# Altium project LAUNCHXL-F28379D_REV2.0.PrjPcb (part 1 of 2)
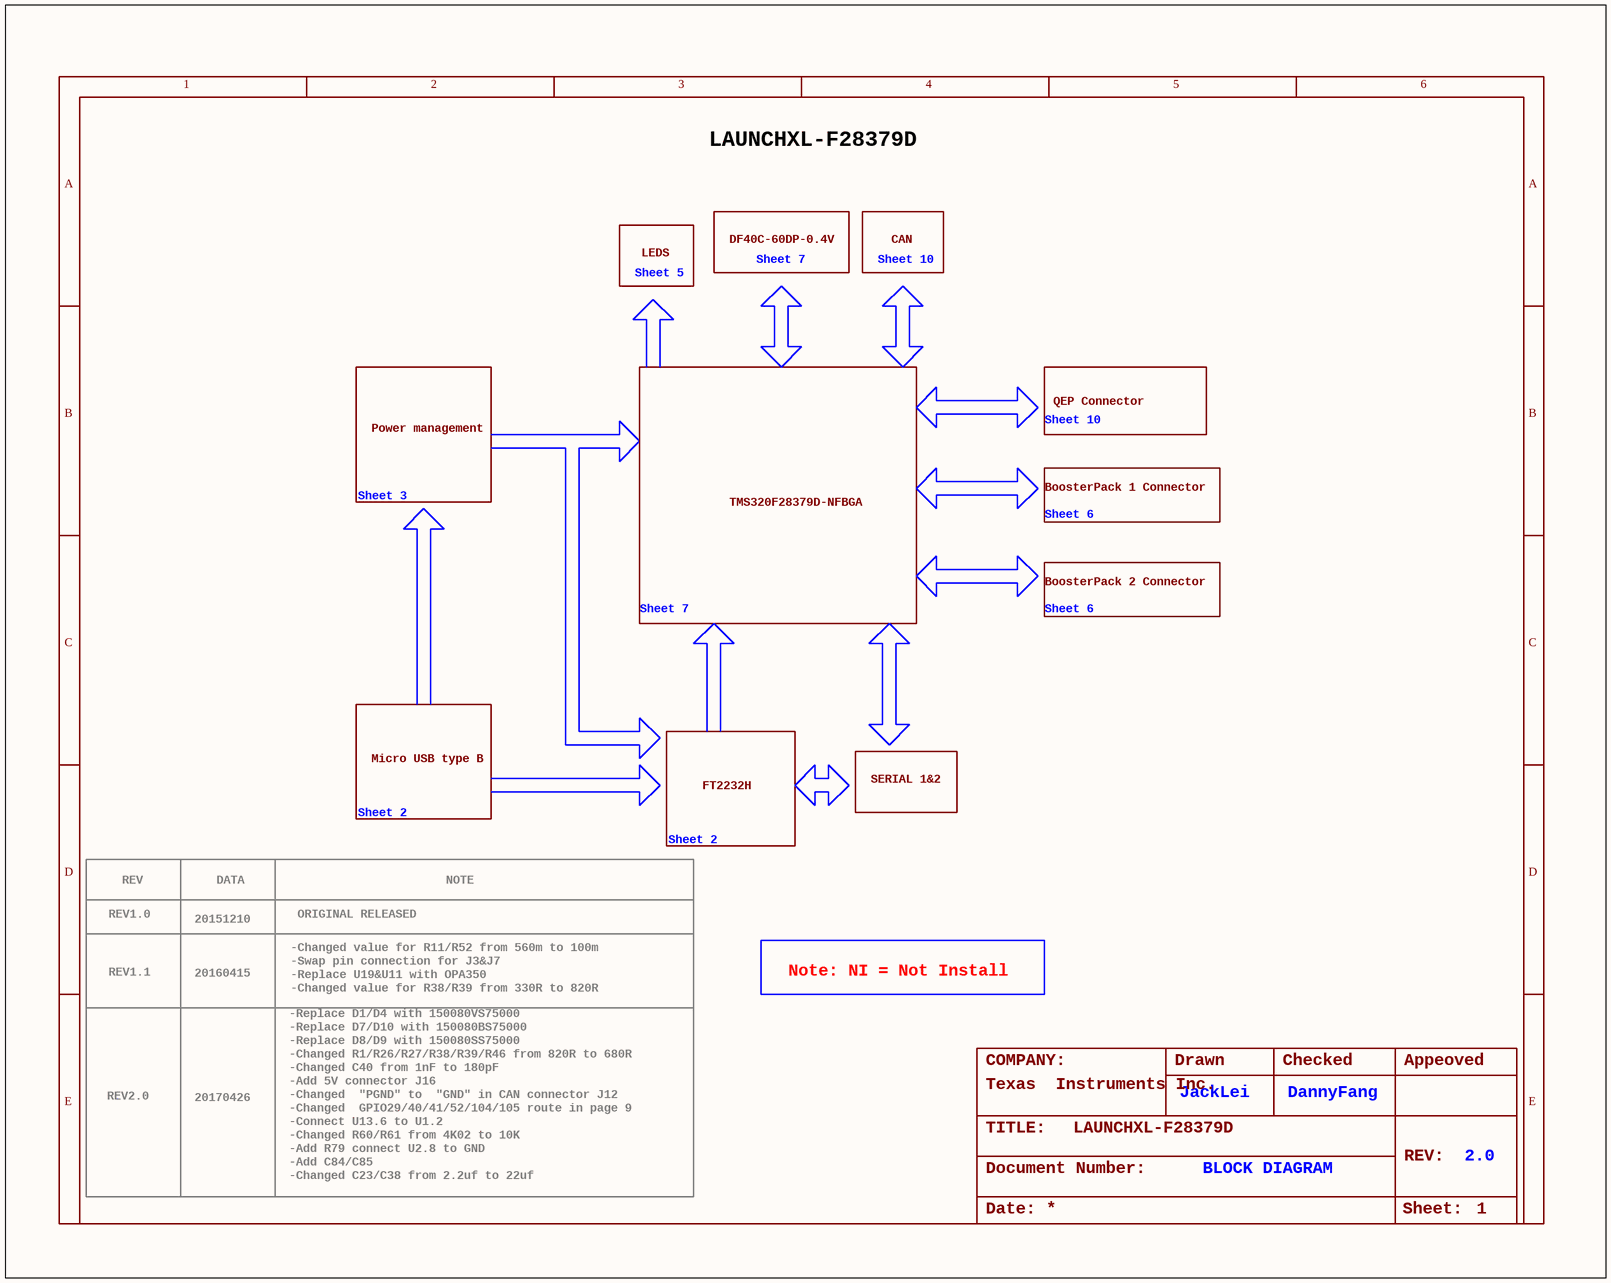
[diagram p0: P01_Block Diagram.SchDoc]
10 sheets, 241 parts. Net scope: global (net labels, ports and power ports of the same name join across sheets).
Board file: LAUNCHXL-F28379D-REV2.0.PcbDoc
Sheets:
  P01_Block Diagram.SchDoc
  P02_XDS100v2.SchDoc
  P03_Power.SchDoc
  P04_ADCIND.SchDoc
  P05_PWM-DAC.SchDoc
  P07_F28379D-PWR.SchDoc
  P08_F28379D-IO1.SchDoc
  P09_F28379D-IO2.SchDoc
  P06_BoosterPack Headers.SchDoc
  P10_EX-Headers.SchDoc

## Sheet P01_Block Diagram.SchDoc
size 301 x 239 mm; SheetNumber: 1; SheetTotal: 10

### Notes on the sheet
- LAUNCHXL-F28379D
- Sheet 5
- LEDS
- DF40C-60DP-0.4V
- Sheet 7
- Sheet 10
- CAN
- QEP Connector
- Power management
- BoosterPack 1 Connector
- Sheet 3
- TMS320F28379D-NFBGA
- Sheet 6
- BoosterPack 2 Connector
- Micro USB type B
- Sheet 2
- FT2232H
- SERIAL 1&2
- REV
- DATA
- NOTE
- REV1.0
- 20151210
- -Changed value for R11/R52 from 560m to 100m
- -Swap pin connection for J3&J7
- ORIGINAL RELEASED
- REV1.1
- 20160415
- -Replace D1/D4 with 150080VS75000
- -Replace D7/D10 with 150080BS75000
- -Replace U19&U11 with OPA350
- -Changed value for R38/R39 from 330R to 820R
- Note: NI = Not Install
- REV2.0
- 20170426
- -Add 5V connector J16
- -Changed R1/R26/R27/R38/R39/R46 from 820R to 680R
- -Replace D8/D9 with 150080SS75000
- -Changed C40 from 1nF to 180pF
- -Changed  "PGND" to  "GND" in CAN connector J12
- COMPANY:
- Texas
  Instruments Inc.
- Drawn
- JackLei
- Checked
- DannyFang
- Appeoved
- -Changed  GPIO29/40/41/52/104/105 route in page 9
- -Connect U13.6 to U1.2
- -Changed R60/R61 from 4K02 to 10K
- -Add R79 connect U2.8 to GND
- -Add C84/C85
- TITLE:
- REV:
- 2.0
- -Changed C23/C38 from 2.2uf to 22uf
- Date:
- Document Number:
- BLOCK DIAGRAM
- Sheet:
- 1
- 2
- 3
- 4
- 5
- 6
- A
- B
- C
- D
- E

## Sheet P02_XDS100v2.SchDoc
size 301 x 239 mm; Revision: 2.0; PageSetup: Record=PageOptions|CenterHorizontal=True|CenterVertical=True|PrintScale=1.00|XCorrection=1.00|YCorrection=1.00|PrintKind=1|BorderSize=5000000|LeftOffset=0|BottomOffset=0|Orientation=2|PaperLength=1000|PaperWidth=1000|Scale=100|PaperSource=7|PrintQuality=-3|MediaType=1|DitherType=10|PrintScaleMode=1|PaperKind=A4 (210 x 297 mm)|PaperIndex=9
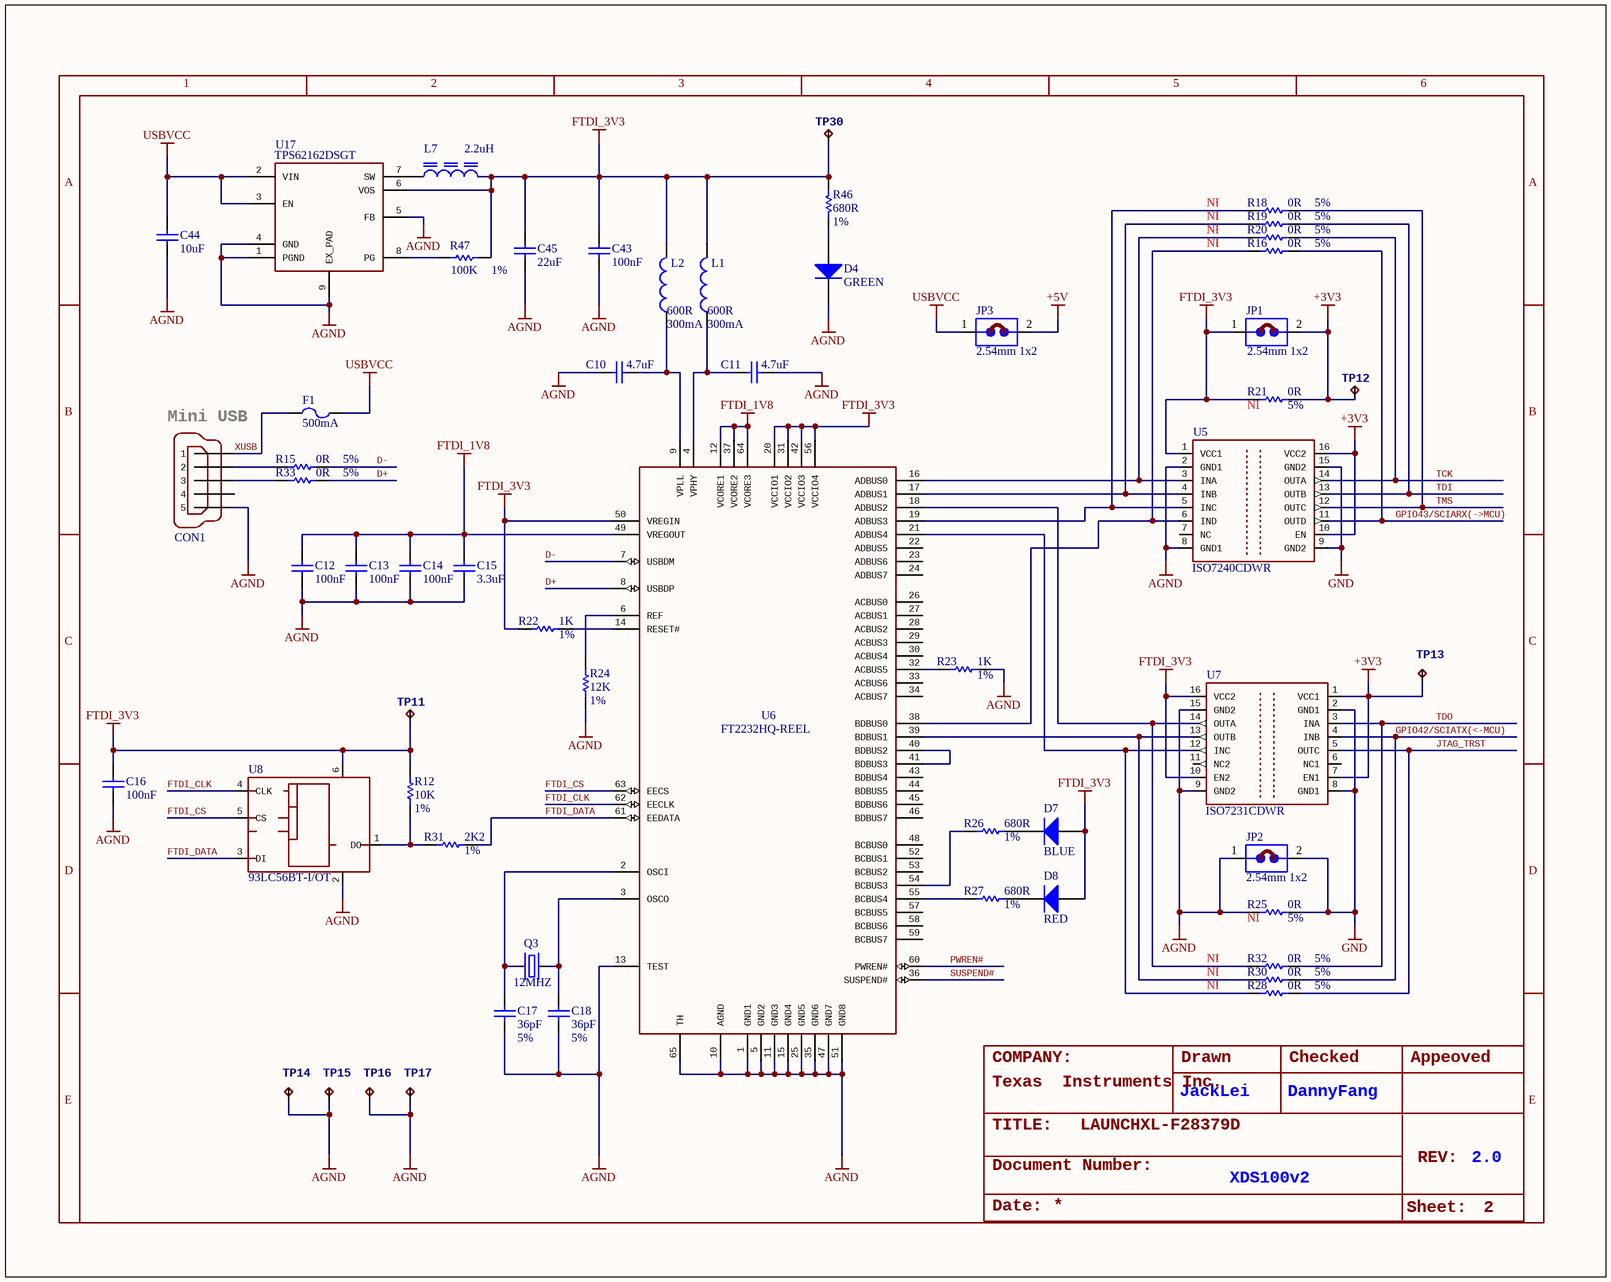
[diagram p1: P02_XDS100v2.SchDoc]

### Parts
C10  4.7uF  [C0402]
C11  4.7uF  [C0402]
C12  100nF  [C0402]
C13  100nF  [C0402]
C14  100nF  [C0402]
C15  3.3uF  [C0603]
C16  100nF  [C0402]
C17  Rating: 5%  [C0402]  (hidden comment: 36pF)
C18  Rating: 5%  [C0402]  (hidden comment: 36pF)
C43  100nF  [C0402]
C44  10uF  [C1210]
C45  22uF  [C1210]
CON1  897-43-005-00-100001  [USB-MINI-B-5P-SMD]  (value not drawn)
D4  value GREEN  [D0805]  (hidden comment: 150080VS75000)
D7  value BLUE  [D0805]  (hidden comment: 150080BS75000)
D8  value RED  [D0805]  (hidden comment: 150080SS75000)
F1  value 500mA  [FUSM4632X85N]  (hidden comment: MF-MSMF050-2)
JP1  value 2.54mm 1x2  [HDRV2W64P254_1X2_508X250X850P]  (hidden comment: P6E02A-602530-B1)
JP2  value 2.54mm 1x2  [HDRV2W64P254_1X2_508X250X850P]  (hidden comment: P6E02A-602530-B1)
JP3  value 2.54mm 1x2  [HDRV2W64P254_1X2_508X250X850P]  (hidden comment: P6E02A-602530-B1)
L1  Rating: 300mA  [L0402]  (hidden comment: 600R)
L2  Rating: 300mA  [L0402]  (hidden comment: 600R)
L7  2.2uH  [INDC300X300X180N]
Q3  value 12MHZ  [XTAL1140X470X330N]  (hidden comment: ABLS2-12.000MHZ-D4Y-T)
R12  Rating: 1%  [R0402]  (hidden comment: 10K)
R15  Rating: 5%  [R0402]  (hidden comment: 0R)
R16  Rating: 5%  ASSY: NI  [R1206]  (hidden comment: 0R)
R18  Rating: 5%  ASSY: NI  [R1206]  (hidden comment: 0R)
R19  Rating: 5%  ASSY: NI  [R1206]  (hidden comment: 0R)
R20  Rating: 5%  ASSY: NI  [R1206]  (hidden comment: 0R)
R21  Rating: 5%  ASSY: NI  [R1206]  (hidden comment: 0R)
R22  Rating: 1%  [R0402]  (hidden comment: 1K)
R23  Rating: 1%  [R0402]  (hidden comment: 1K)
R24  Rating: 1%  [R0402]  (hidden comment: 12K)
R25  Rating: 5%  ASSY: NI  [R1206]  (hidden comment: 0R)
R26  Rating: 1%  [R0402]  (hidden comment: 680R)
R27  Rating: 1%  [R0402]  (hidden comment: 680R)
R28  Rating: 5%  ASSY: NI  [R1206]  (hidden comment: 0R)
R30  Rating: 5%  ASSY: NI  [R1206]  (hidden comment: 0R)
R31  Rating: 1%  [R0402]  (hidden comment: 2K2)
R32  Rating: 5%  ASSY: NI  [R1206]  (hidden comment: 0R)
R33  Rating: 5%  [R0402]  (hidden comment: 0R)
R46  Rating: 1%  [R0402]  (hidden comment: 680R)
R47  Rating: 1%  [R0402]  (hidden comment: 100K)
TP11  TESTPAD_TPB1,27  [TESTPAD_B1,27]  (value not drawn)
TP12  TESTPAD_TPB1,27  [TESTPAD_B1,27]  (value not drawn)
TP13  TESTPAD_TPB1,27  [TESTPAD_B1,27]  (value not drawn)
TP14  TESTPAD_TPB1,27  [TESTPAD_B1,27]  (value not drawn)
TP15  TESTPAD_TPB1,27  [TESTPAD_B1,27]  (value not drawn)
TP16  TESTPAD_TPB1,27  [TESTPAD_B1,27]  (value not drawn)
TP17  TESTPAD_TPB1,27  [TESTPAD_B1,27]  (value not drawn)
TP30  TESTPAD_TPB1,27  [TESTPAD_B1,27]  (value not drawn)
U5  ISO7240CDWR  [SOIC127P1030X265-16N]
U6  FT2232HQ-REEL  [QFN50P900X900X100_HS-65N]
U7  ISO7231CDWR  [SOIC127P1030X265-16N]
U8  93LC56BT-I/OT  [SOT23-6]
U17  TPS62162DSGT  [WSON50P200X80_HS-9N]
U$2  ROY_JUMPER  [ROY_JUMPER]  (value not drawn)
U$10  ROY_JUMPER  [ROY_JUMPER]  (value not drawn)
U$11  ROY_JUMPER  [ROY_JUMPER]  (value not drawn)

### Nets
+3V3: JP1.2 R21.2 TP12.TP TP13.TP U5.10(EN) U5.16(VCC2) U7.1(VCC1) U7.7(EN1)
+5V: JP3.2
AGND: C10.1 C11.1 C12.1 C13.1 C14.1 C15.1 C16.1 C17.1 C18.1 C43.1 C44.2 C45.1 CON1.5 D4.1 JP2.1 R23.2 R24.1 R25.1 TP14.TP TP15.TP TP16.TP TP17.TP U5.2(GND1) U5.8(GND1) U6.1(GND1) U6.5(GND2) U6.10(AGND) U6.11(GND3) U6.13(TEST) U6.15(GND4) U6.25(GND5) U6.35(GND6) U6.47(GND7) U6.51(GND8) U6.65(TH) U7.9(GND2) U7.15(GND2) U8.2(GND) U17.1(PGND) U17.4(GND) U17.5(FB) U17.9(EX_PAD)
FTDI_1V8: C12.2 C13.2 C14.2 C15.2 U6.12(VCORE1) U6.37(VCORE2) U6.49(VREGOUT) U6.64(VCORE3)
FTDI_3V3: C16.2 C43.2 C45.2 D7.2 D8.2 JP1.1 L1.2 L2.2 L7.1 R12.1 R21.1 R22.1 R46.2 R47.1 TP11.TP TP30.TP U5.1(VCC1) U6.20(VCCIO1) U6.31(VCCIO2) U6.42(VCCIO3) U6.50(VREGIN) U6.56(VCCIO4) U7.10(EN2) U7.16(VCC2) U8.6(VCC) U17.6(VOS)
GND: JP2.2 R25.2 U5.9(GND2) U5.15(GND2) U7.2(GND1) U7.8(GND1)
USBVCC: C44.1 F1.2 JP3.1 U17.2(VIN) U17.3(EN)
D+: R33.2 U6.8(USBDP)
D-: R15.2 U6.7(USBDM)
FTDI_CLK: U6.62(EECLK) U8.4(CLK)
FTDI_CS: U6.63(EECS) U8.5(CS)
FTDI_DATA: R31.2 U6.61(EEDATA) U8.3(DI)
GPIO42/SCIATX(<-MCU): R30.2 U7.4(INB)
GPIO43/SCIARX(->MCU): R16.2 U5.11(OUTD)
JTAG_TRST: R28.2 U7.5(OUTC)
PWREN#: U6.60(PWREN#)
SUSPEND#: U6.36(SUSPEND#)
TCK: R20.2 U5.14(OUTA)
TDI: R19.2 U5.13(OUTB)
TDO: R32.2 U7.3(INA)
TMS: R18.2 U5.12(OUTC)
XUSB: CON1.1 F1.1
NetC10_2: C10.2 L2.1 U6.9(VPLL)
NetC11_2: C11.2 L1.1 U6.4(VPHY)
NetC17_2: C17.2 Q3.1 U6.2(OSCI)
NetC18_2: C18.2 Q3.2 U6.3(OSCO)
NetCON1_2: CON1.2 R15.1
NetCON1_3: CON1.3 R33.1
NetD4_2: D4.2 R46.1
NetD7_1: D7.1 R26.2
NetD8_1: D8.1 R27.2
NetL7_2: L7.2 U17.7(SW)
NetR12_2: R12.2 R31.1 U8.1(DO)
NetR16_1: R16.1 U5.6(IND) U6.38(BDBUS0)
NetR18_1: R18.1 U5.5(INC) U6.19(ADBUS3)
NetR19_1: R19.1 U5.4(INB) U6.17(ADBUS1)
NetR20_1: R20.1 U5.3(INA) U6.16(ADBUS0)
NetR22_2: R22.2 U6.14(RESET#)
NetR23_1: R23.1 U6.32(ACBUS5)
NetR24_2: R24.2 U6.6(REF)
NetR26_1: R26.1 U6.54(BCBUS3)
NetR27_1: R27.1 U6.55(BCBUS4)
NetR28_1: R28.1 U6.21(ADBUS4) U7.12(INC)
NetR30_1: R30.1 U6.39(BDBUS1) U7.13(OUTB)
NetR32_1: R32.1 U6.18(ADBUS2) U7.14(OUTA)
NetR47_2: R47.2 U17.8(PG)
NetU6_40: U6.40(BDBUS2) U6.41(BDBUS3)

Not connected (* = marked no-connect by the designer): CON1 4; U5 7(NC); U6 22(ADBUS5) 23(ADBUS6) 24(ADBUS7) 26(ACBUS0) 27(ACBUS1) 28(ACBUS2) 29(ACBUS3) 30(ACBUS4) 33(ACBUS6) 34(ACBUS7) 43(BDBUS4) 44(BDBUS5) 45(BDBUS6) 46(BDBUS7) 48(BCBUS0) 52(BCBUS1) 53(BCBUS2) 57(BCBUS5) 58(BCBUS6) 59(BCBUS7); U7 6(NC1) 11(NC2)

### Notes on the sheet
- (near CON1) Mini USB
- COMPANY:
- Texas
  Instruments Inc.
- JackLei
- Drawn
- DannyFang
- Checked
- Appeoved
- TITLE:
- Document Number:
- LAUNCHXL-F28379D
- REV:
- Date:
- XDS100v2
- Sheet:
- 2
- 1
- 3
- 4
- 5
- 6
- A
- B
- C
- D
- E

### Library data of the parts
C10 C11 = 1004001100218: CAP,4.7UF,+/-20%,X5R,6.3V,SMD0402 fix PN add D（20151023）; Manufacturer: MURATA; Manufacturer Part Number: GRM155R60J475ME47D; Rating: 20%; Embest PN: 1004001100218; Value: 4.7uF; Part Type: Ceramic Capacitor
C12-C14 C16 C43 = 1004001100187: CAP,100NF(0.1uf),+/-10%,X5R,10V,SMD0402; Manufacturer: MURATA; Manufacturer Part Number: GRM155R61A104KA01D; Rating: 10%; Embest PN: 1004001100187; Value: 100nF; Part Type: Ceramic Capacitor
C15 = 1004001100252: CAP,3.3uF,+/-10%,X5R,10V,SMD0603; Manufacturer: MURATA; Manufacturer Part Number: GRM188R61A335KE15D; Rating: 10%; Embest PN: 1004001100252; Value: 3.3uF; Part Type: Ceramic Capacitor
C17 C18 = 1004001100255: CAP,36pF,+/-5%,C0G,50V,SMD0402; Manufacturer: MURATA; Manufacturer Part Number: GRM1555C1H360JA01D; Embest PN: 1004001100255; Value: 36pF; Part Type: Ceramic Capacitor
C44 = 1004001100183: CAP,10UF,+/-10%,X7R,25V,SMD1210; Manufacturer: MURATA; Manufacturer Part Number: GRM32DR71E106KA12L; Rating: 10%; Embest PN: 1004001100183; Value: 10uF; Part Type: Ceramic Capacitor
C45 = 1004001100216: CAP,22UF,+/-10%,X7R,25V,SMD1210; Manufacturer: MURATA; Manufacturer Part Number: GRM32ER61E226KE15L; Rating: 10%; Embest PN: 1004001100216; Value: 22uF; Part Type: Ceramic Capacitor
CON1 = 1009007100067: Connector,MiniUSB B port,5 position,Right Angle,Gold flash 30u,black,SMD; Manufacturer: MILL-MAX; Embest PN: 1009007100067; Value: 897-43-005-00-100001; Part Type: USB Connector; Manufacturer Part Number: 897-43-005-00-100001
D4 = 1006001100166: LED, Bright GREEN , 570nm,30mA,SMD,0805; Manufacturer: WURTH; Embest PN: 1006001100166; Part Type: LED; Manufacturer Part Number: 150080VS75000
D7 = 1006001100167: LED, BLUE ,470NM, 30mA,SMD,0805; Manufacturer: WURTH; Embest PN: 1006001100167; Part Type: LED; Manufacturer Part Number: 150080BS75000
D8 = 1006001100168: LED, SUPPER RED ,630NM,30mA, SMD,0805; Manufacturer: WURTH; Embest PN: 1006001100168; Part Type: LED; Manufacturer Part Number: 150080SS75000
F1 = 1007001100029: PTC RESETTABLE .50A 15V 1812; Manufacturer: BOURNS; Embest PN: 1007001100029; Part Type: Polyswitch; Manufacturer Part Number: MF-MSMF050-2
JP1-JP3 = 1009001200003: Connector,Pin Header,Straight,Male,1x2Pin,2.54MM pitch,6.00,3.00,Gold Flash 1u, black,DIP,alt_code:15071705; Manufacturer: CHIN-BAN; Embest PN: 1009001200003; Part Type: Pin Header; Manufacturer Part Number: P6E02A-602530-B1
L1 L2 = 1005005100003: Ferrite Bead,600ohm@100MHz,+/-25%,300mA,0.6ohm,SMD0402; Manufacturer: MURATA; Manufacturer Part Number: BLM15AG601SN1D; Embest PN: 1005005100003; Value: 600R; Part Type: Ferrite Bead
L7 = 1005004100011: Power Inductor,Magnetic shielded,2.2uH,1.6A,0.06ohm,3.0X3.0X1.8mm,SMD; Manufacturer: SUMIDA; Manufacturer Part Number: CDRH2D18/HPNP-2R2NC; Embest PN: 1005004100011; Value: 2.2uH; Part Type: Inductor; Rating: 1.6A
Q3 = 1008002100130: Crystal 12MHz ±30ppm (Tol) ±30ppm (Stability) 18pF FUND 50Ohm 2-Pin HC-49/US SMD T/R; Manufacturer: ABRACON; Embest PN: 1008002100130; Part Type: Crystal; Manufacturer Part Number: ABLS2-12.000MHZ-D4Y-T
R12 = 1003001100071: RES,10K,+/-1%,1/16W,SMD0402; Manufacturer: YAGEO; Manufacturer Part Number: RC0402FR-0710KL; Embest PN: 1003001100071; Value: 10K; Part Type: Thick film Resistor
R15 R33 = 1003001100001: RES,0R,+/-5%,1/16W,SMD0402; Manufacturer: YAGEO; Manufacturer Part Number: RC0402JR-070RL; Embest PN: 1003001100001; Value: 0R; Part Type: Thick film Resistor
R16 R18-R21 R25 R28 R30 R32 = 1003001100325: RES,0R,+/-5%,1/2W,SMD1206; Manufacturer: YAGEO; Manufacturer Part Number: RC1206JR-7W0RL; Embest PN: 1003001100325; Value: 0R; Part Type: Thick film Resistor
R22 R23 = 1003001100034: RES,1K,+/-1%,1/16W,SMD0402; Manufacturer: YAGEO; Manufacturer Part Number: RC0402FR-071KL; Embest PN: 1003001100034; Value: 1K; Part Type: Thick film Resistor
R24 = 1003001100075: RES,12K,+/-1%,1/16W,SMD0402; Manufacturer: YAGEO; Manufacturer Part Number: RC0402FR-0712KL; Embest PN: 1003001100075; Value: 12K; Part Type: Thick film Resistor
R26 R27 R46 = 1003001100490: RES,680R,+/-1%,1/16W,SMD0402; Manufacturer: YAGEO; Manufacturer Part Number: RC0402FR-07680RL; Embest PN: 1003001100490; Value: 680R; Part Type: Thick film Resistor
R31 = 1003001100045: RES,2K2,+/-1%,1/16W,SMD0402; Manufacturer: YAGEO; Manufacturer Part Number: RC0402FR-072K2L; Embest PN: 1003001100045; Value: 2K2; Part Type: Thick film Resistor
R47 = 1003001100120: RES,100K,+/-1%,1/16W,SMD0402; Manufacturer: YAGEO; Manufacturer Part Number: RC0402FR-07100KL; Embest PN: 1003001100120; Value: 100K; Part Type: Thick film Resistor
TP11-TP17 TP30 = TESTPAD_TPB1,27: Test pad
U5 = 1002017100004C: IC DGTL ISO 4CH CMOS 16SOIC,CUSTOMER SUPPLY; Manufacturer: TI; Embest PN: 1002017100004C; Value: ISO7240CDWR; Part Type: Isolator; Manufacturer Part Number: ISO7240CDWR
U6 = 1002010100084: IC,Dual High Speed USB to Multipurpose UART/FIFO IC,FT2232HQ-REEL,QFN-64,SMD; Manufacturer: FTDI; Embest PN: 1002010100084; Value: FT2232HQ-REEL; Part Type: Interface; Manufacturer Part Number: FT2232HQ-REEL
U7 = 1002017100003C: IC DGTL ISO 3CH CMOS 16SOIC,CUSTOMER SUPPLY; Manufacturer: TI; Embest PN: 1002017100003C; Value: ISO7231CDWR; Part Type: Isolator; Manufacturer Part Number: ISO7231CDWR
U8 = 1002003100163: IC,EEPROM Serial-Microwire 2K-Bit 128 x 16 2MHz,93LC56BT-I/OT,SOT-23-6,SMD; Manufacturer: MICROCHIP; Embest PN: 1002003100163; Value: 93LC56BT-I/OT; Part Type: Memory; Manufacturer Part Number: 93LC56BT-I/OT
U17 = 1002005100090C: IC REG BUCK SYNC 3.3V 1A 8WSON; Manufacturer: TI; Embest PN: 1002005100090C; Value: TPS62162DSGT; Part Type: DC-DC; Manufacturer Part Number: TPS62162DSGT

## Sheet P03_Power.SchDoc
size 301 x 239 mm
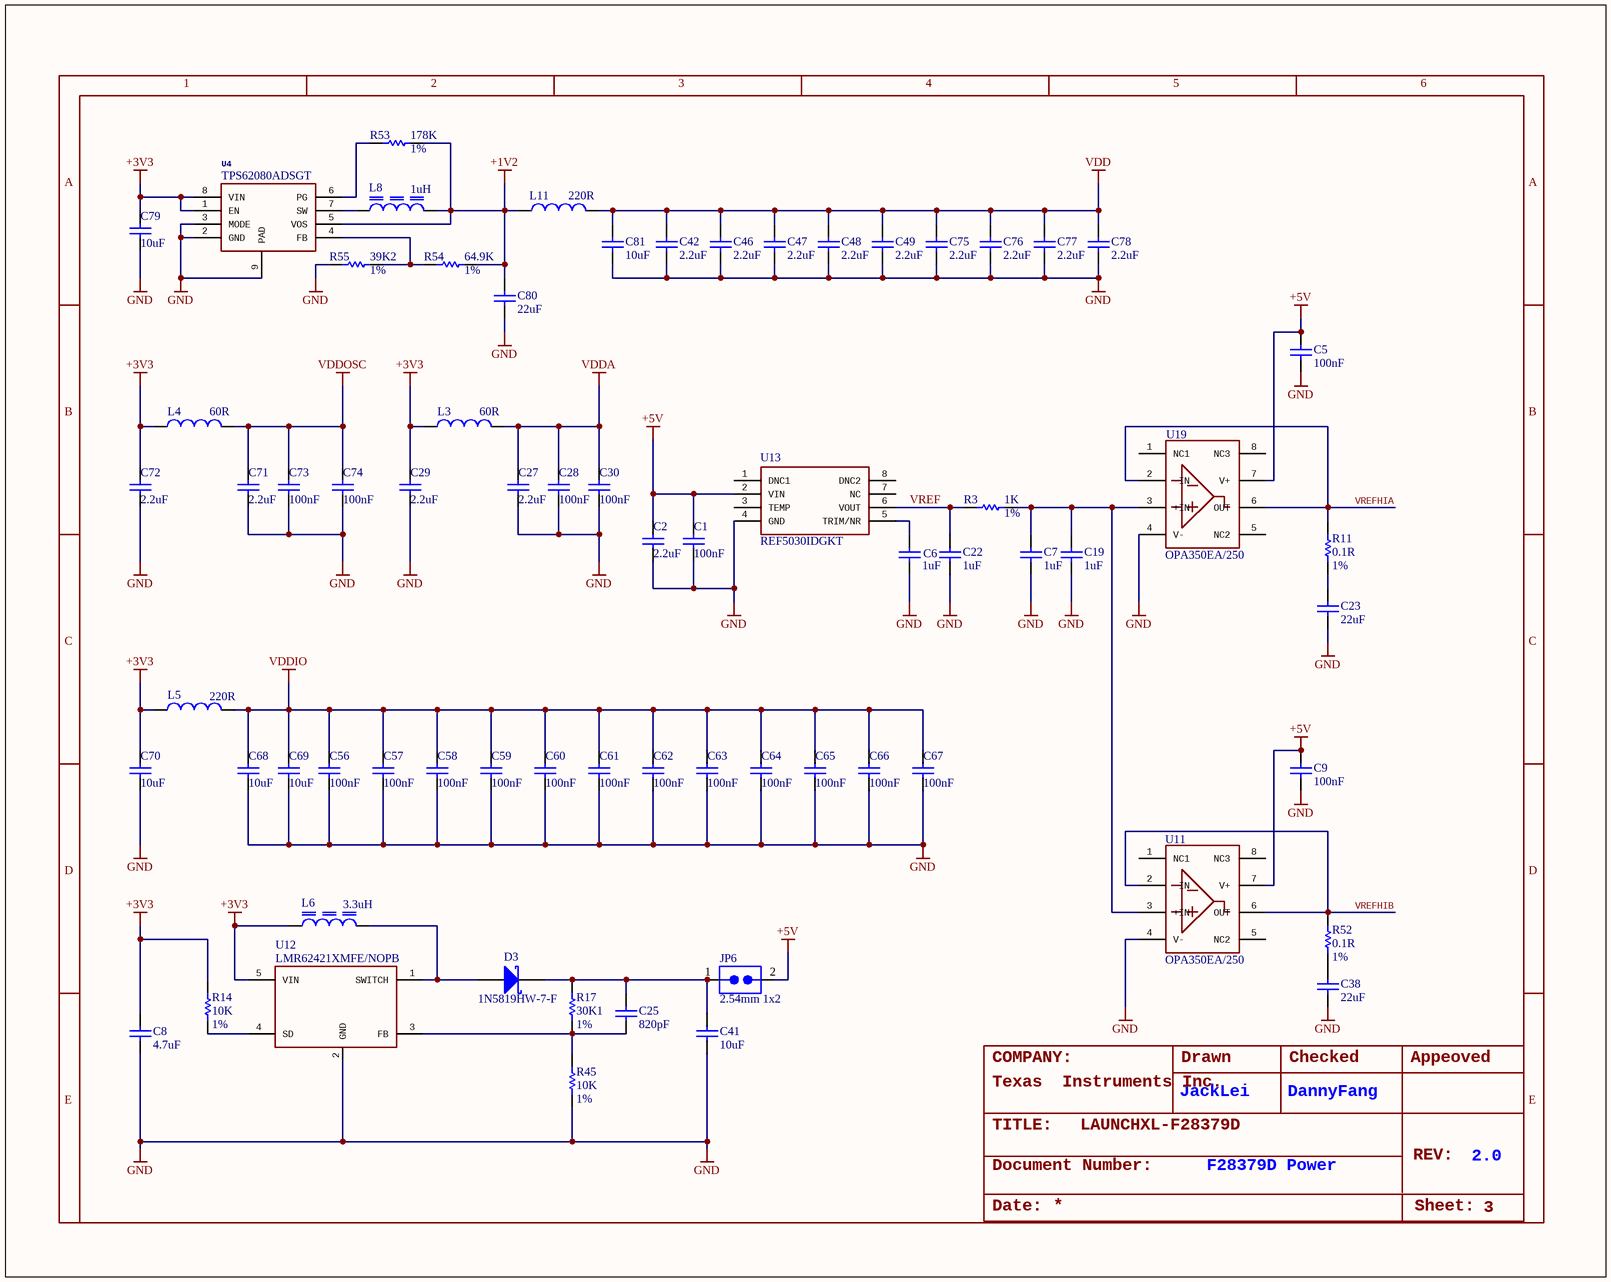
[diagram p2: P03_Power.SchDoc]

### Parts
C1  100nF  [C0402]
C2  2.2uF  [C0402]
C5  100nF  [C0402]
C6  1uF  [C0402]
C7  1uF  [C0402]
C8  4.7uF  [C0402]
C9  100nF  [C0402]
C19  1uF  [C0402]
C22  1uF  [C0402]
C23  22uF  [C0603]
C25  820pF  [C0402]
C27  2.2uF  [C0402]
C28  100nF  [C0402]
C29  2.2uF  [C0402]
C30  100nF  [C0402]
C38  22uF  [C0603]
C41  10uF  [C1210]
C42  2.2uF  [C0402]
C46  2.2uF  [C0402]
C47  2.2uF  [C0402]
C48  2.2uF  [C0402]
C49  2.2uF  [C0402]
C56  100nF  [C0402]
C57  100nF  [C0402]
C58  100nF  [C0402]
C59  100nF  [C0402]
C60  100nF  [C0402]
C61  100nF  [C0402]
C62  100nF  [C0402]
C63  100nF  [C0402]
C64  100nF  [C0402]
C65  100nF  [C0402]
C66  100nF  [C0402]
C67  100nF  [C0402]
C68  10uF  [C0603]
C69  10uF  [C0603]
C70  10uF  [C0603]
C71  2.2uF  [C0402]
C72  2.2uF  [C0402]
C73  100nF  [C0402]
C74  100nF  [C0402]
C75  2.2uF  [C0402]
C76  2.2uF  [C0402]
C77  2.2uF  [C0402]
C78  2.2uF  [C0402]
C79  10uF  [C0603]
C80  22uF  [C0603]
C81  10uF  [C0603]
D3  1N5819HW-7-F  [SOD-123]
JP6  value 2.54mm 1x2  [HDRV2W64P254_1X2_508X250X850P]  (hidden comment: P6E02A-602530-B1)
L3  60R  [L0402]
L4  60R  [L0402]
L5  220R  [L0402]
L6  3.3uH  [INDC380X380X165N]
L8  1uH  [INDC3030X12N]
L11  220R  [L0402]
R3  Rating: 1%  [R0402]  (hidden comment: 1K)
R11  Rating: 1%  [R0603]  (hidden comment: 0.1R)
R14  Rating: 1%  [R0402]  (hidden comment: 10K)
R17  Rating: 1%  [R0402]  (hidden comment: 30K1)
R45  Rating: 1%  [R0402]  (hidden comment: 10K)
R52  Rating: 1%  [R0603]  (hidden comment: 0.1R)
R53  Rating: 1%  [R0402]  (hidden comment: 178K)
R54  Rating: 1%  [R0402]  (hidden comment: 64.9K)
R55  Rating: 1%  [R0402]  (hidden comment: 39K2)
U4  TPS62080ADSGT  [WSON50P200X80_HS-9N]
U11  OPA350EA/250  [VSSOP65P490X110-8N]
U12  LMR62421XMFE/NOPB  [SOT23-5]
U13  REF5030IDGKT  [VSSOP65P490X110-8N]
U19  OPA350EA/250  [VSSOP65P490X110-8N]

### Nets
+1V2: C80.2 L8.2 L11.1 R53.2 R54.2 U4.5(VOS)
+3V3: C8.2 C29.2 C70.2 C72.2 C79.2 L3.1 L4.1 L5.1 L6.1 R14.1 U4.1(EN) U4.8(VIN) U12.5(VIN)
+5V: C1.2 C2.2 C5.2 C9.2 JP6.2 U11.7(V+) U13.2(VIN) U19.7(V+)
GND: C1.1 C2.1 C5.1 C6.1 C7.1 C8.1 C9.1 C19.1 C22.1 C23.1 C27.1 C28.1 C29.1 C30.1 C38.1 C41.2 C42.1 C46.1 C47.1 C48.1 C49.1 C56.1 C57.2 C58.1 C59.1 C60.1 C61.1 C62.1 C63.1 C64.1 C65.1 C66.1 C67.1 C68.1 C69.1 C70.1 C71.1 C72.1 C73.1 C74.1 C75.1 C76.1 C77.1 C78.1 C79.1 C80.1 C81.1 R45.2 R55.1 U4.2(GND) U4.3(MODE) U4.9(PAD) U11.4(V-) U12.2(GND) U13.4(GND) U19.4(V-)
VDD: C42.2 C46.2 C47.2 C48.2 C49.2 C75.2 C76.2 C77.2 C78.2 C81.2 L11.2
VDDA: C27.2 C28.2 C30.2 L3.2
VDDIO: C56.2 C57.1 C58.2 C59.2 C60.2 C61.2 C62.2 C63.2 C64.2 C65.2 C66.2 C67.2 C68.2 C69.2 L5.2
VDDOSC: C71.2 C73.2 C74.2 L4.2
VREF: C22.2 R3.1 U13.6(VOUT)
VREFHIA: R11.2 U19.2(-IN) U19.6(OUT)
VREFHIB: R52.2 U11.2(-IN) U11.6(OUT)
NetC6_2: C6.2 U13.5(TRIM/NR)
NetC7_2: C7.2 C19.2 R3.2 U11.3(+IN) U19.3(+IN)
NetC23_2: C23.2 R11.1
NetC25_1: C25.1 R17.2 R45.1 U12.3(FB)
NetC25_2: C25.2 C41.1 D3.1 JP6.1 R17.1
NetC38_2: C38.2 R52.1
NetD3_2: D3.2 L6.2 U12.1(SWITCH)
NetL8_1: L8.1 U4.7(SW)
NetR14_2: R14.2 U12.4(SD)
NetR53_1: R53.1 U4.6(PG)
NetR54_1: R54.1 R55.2 U4.4(FB)

Not connected (* = marked no-connect by the designer): U11 1(NC1) 5(NC2) 8(NC3); U13 1(DNC1) 3(TEMP) 7(NC) 8(DNC2); U19 1(NC1) 5(NC2) 8(NC3)

### Notes on the sheet
- COMPANY:
- Texas
  Instruments Inc.
- JackLei
- Drawn
- DannyFang
- Checked
- Appeoved
- TITLE:
- Document Number:
- LAUNCHXL-F28379D
- F28379D Power
- REV:
- 2.0
- Date:
- Sheet:
- 3
- 1
- 2
- 4
- 5
- 6
- A
- B
- C
- D
- E

### Library data of the parts
C1 C5 C9 C28 C30 C56-C67 C73 C74 = 1004001100187: as C12 on sheet P02_XDS100v2; Embest PN: 1004001100187; Value: 100nF; Part Type: Ceramic Capacitor
C2 C27 C29 C42 C46-C49 C71 C72 C75-C78 = 1004001100059: CAP,2.2UF,+/-20%,X5R,6.3V,SMD0402; Manufacturer: MURATA; Manufacturer Part Number: GRM155R60J225ME15D; Rating: 20%; Embest PN: 1004001100059; Value: 2.2uF; Part Type: Ceramic Capacitor
C6 C7 C19 C22 = 1004001100056: CAP,1UF,+/-10%,X5R,6.3V,SMD0402; Manufacturer: MURATA; Manufacturer Part Number: GRM155R60J105KE19D; Rating: 10%; Embest PN: 1004001100056; Value: 1uF; Part Type: Ceramic Capacitor
C8 = 1004001100218: as C10 on sheet P02_XDS100v2; Embest PN: 1004001100218; Value: 4.7uF; Part Type: Ceramic Capacitor
C23 C38 C80 = 1004001100130: CAP,22UF,+/-20%,X5R,6.3V,SMD0603; Manufacturer: MURATA; Manufacturer Part Number: GRM188R60J226MEA0D; Rating: 20%; Embest PN: 1004001100130; Value: 22uF; Part Type: Ceramic Capacitor
C25 = 1004001100029: CAP,820PF,+/-5%,C0G,50V,SMD0402; Manufacturer: MURATA; Manufacturer Part Number: GRM1555C1H821JA01D; Rating: 5%; Embest PN: 1004001100029; Value: 820pF; Part Type: Ceramic Capacitor
C41 = 1004001100183: as C44 on sheet P02_XDS100v2; Embest PN: 1004001100183; Value: 10uF; Part Type: Ceramic Capacitor
C68-C70 C79 C81 = 1004001100128: CAP,10UF,+/-20%,X5R,6.3V,SMD0603; Manufacturer: MURATA; Manufacturer Part Number: GRM188R60J106ME47D; Rating: 20%; Embest PN: 1004001100128; Value: 10uF; Part Type: Ceramic Capacitor
D3 = 1006002100003: Diode,Schottky Diode,1N5819HW-7-F,40V,1A,SOD-123,SMD,-65~125,TR; Manufacturer: DIODES; Embest PN: 1006002100003; Value: 1N5819HW-7-F; Part Type: Diode; Rating: 1A; Manufacturer Part Number: 1N5819HW-7-F
JP6 = 1009001200003: as JP1 on sheet P02_XDS100v2; Embest PN: 1009001200003; Part Type: Pin Header; Manufacturer Part Number: P6E02A-602530-B1
L3 L4 = 1005005100005: Ferrite Bead,60ohm@100MHz,+/-25%,1700mA,0.06ohm,SMD0402; Manufacturer: MURATA; Manufacturer Part Number: BLM15PD600SN1D; Embest PN: 1005005100005; Value: 60R; Part Type: Ferrite Bead; Rating: 1700mA
L5 L11 = 1005005100064: FERRITE BEAD 220 OHM 0402,+/-25%; Manufacturer: Taiyo Yuden; Manufacturer Part Number: BKP1005EM221-T; Embest PN: 1005005100064; Value: 220R; Part Type: Ferrite Bead
L6 = 1005004100014: Power Inductor,Magnetic shielded,3.3uH,1.4A,0.085ohm,3.8X3.8X1.6mm,SMD; Manufacturer: SUMIDA; Manufacturer Part Number: CDRH3D16/HPNP-3R3NC; Embest PN: 1005004100014; Value: 3.3uH; Part Type: Inductor; Rating: 1.4A
L8 = 1005001100053: FIXED IND 1UH 1.62A 40 MOHM SMD,+/-30%; Manufacturer: MURATA; Manufacturer Part Number: LQH3NPN1R0NJ0L; Embest PN: 1005001100053; Value: 1uH; Part Type: Inductor; Rating: 1.62A
R3 = 1003001100034: as R22 on sheet P02_XDS100v2; Embest PN: 1003001100034; Value: 1K; Part Type: Thick film Resistor
R11 R52 = 1003001100162: RES,0R1,+/-1%,1/10W,SMD0603; Manufacturer: YAGEO; Manufacturer Part Number: RL0603FR-070R1L; Embest PN: 1003001100162; Value: 0.1R; Part Type: Thick film Resistor
R14 R45 = 1003001100071: as R12 on sheet P02_XDS100v2; Embest PN: 1003001100071; Value: 10K; Part Type: Thick film Resistor
R17 = 1003001100091: RES,30K1,+/-1%,1/16W,SMD0402; Manufacturer: YAGEO; Manufacturer Part Number: RC0402FR-0730K1L; Embest PN: 1003001100091; Value: 30K1; Part Type: Thick film Resistor
R53 = 1003001100723: RES, 178K OHM, 1%, 1/10W, SMD0402; Manufacturer: PANASONIC; Manufacturer Part Number: ERJ-2RKF1783X; Embest PN: 1003001100723; Value: 178K; Part Type: Thick film Resistor
R54 = 1003001100730: RES, 64.9K OHM, 1%, 1/10W, SMD0402; Manufacturer: PANASONIC; Manufacturer Part Number: ERJ-2RKF6492X; Embest PN: 1003001100730; Value: 64.9K; Part Type: Thick film Resistor
R55 = 1003001100098: RES,39K2,+/-1%,1/16W,SMD0402; Manufacturer: YAGEO; Manufacturer Part Number: RC0402FR-0739K2L; Embest PN: 1003001100098; Value: 39K2; Part Type: Thick film Resistor
U4 = 1002005100089C: IC REG BUCK SYNC ADJ 1.2A 8WSON; Manufacturer: TI; Embest PN: 1002005100089C; Value: TPS62080ADSGT; Part Type: DC-DC; Manufacturer Part Number: TPS62080ADSGT
U11 U19 = 1002007100063C: IC OPAMP GP 38MHZ RRO 8VSSOP T/R; Manufacturer: TI; Embest PN: 1002007100063C; Value: OPA350EA/250; Part Type: Amplifier; Manufacturer Part Number: OPA350EA/250
U12 = 1002005100073C: Conv DC-DC Single Step Up 2.7V to 5.5V 5-Pin SOT-23 T/R ,CUSTOMER SUPPLY; Manufacturer: TI; Embest PN: 1002005100073C; Value: LMR62421XMFE/NOPB; Part Type: DC-DC; Manufacturer Part Number: LMR62421XMFE/NOPB
U13 = 1002004100186C: IC ，V-Ref Precision 3V 10mA 8-Pin VSSOP T/R; Manufacturer: TI; Embest PN: 1002004100186C; Value: REF5030IDGKT; Part Type: Power Management; Manufacturer Part Number: REF5030IDGKT

## Sheet P04_ADCIND.SchDoc
size 301 x 239 mm
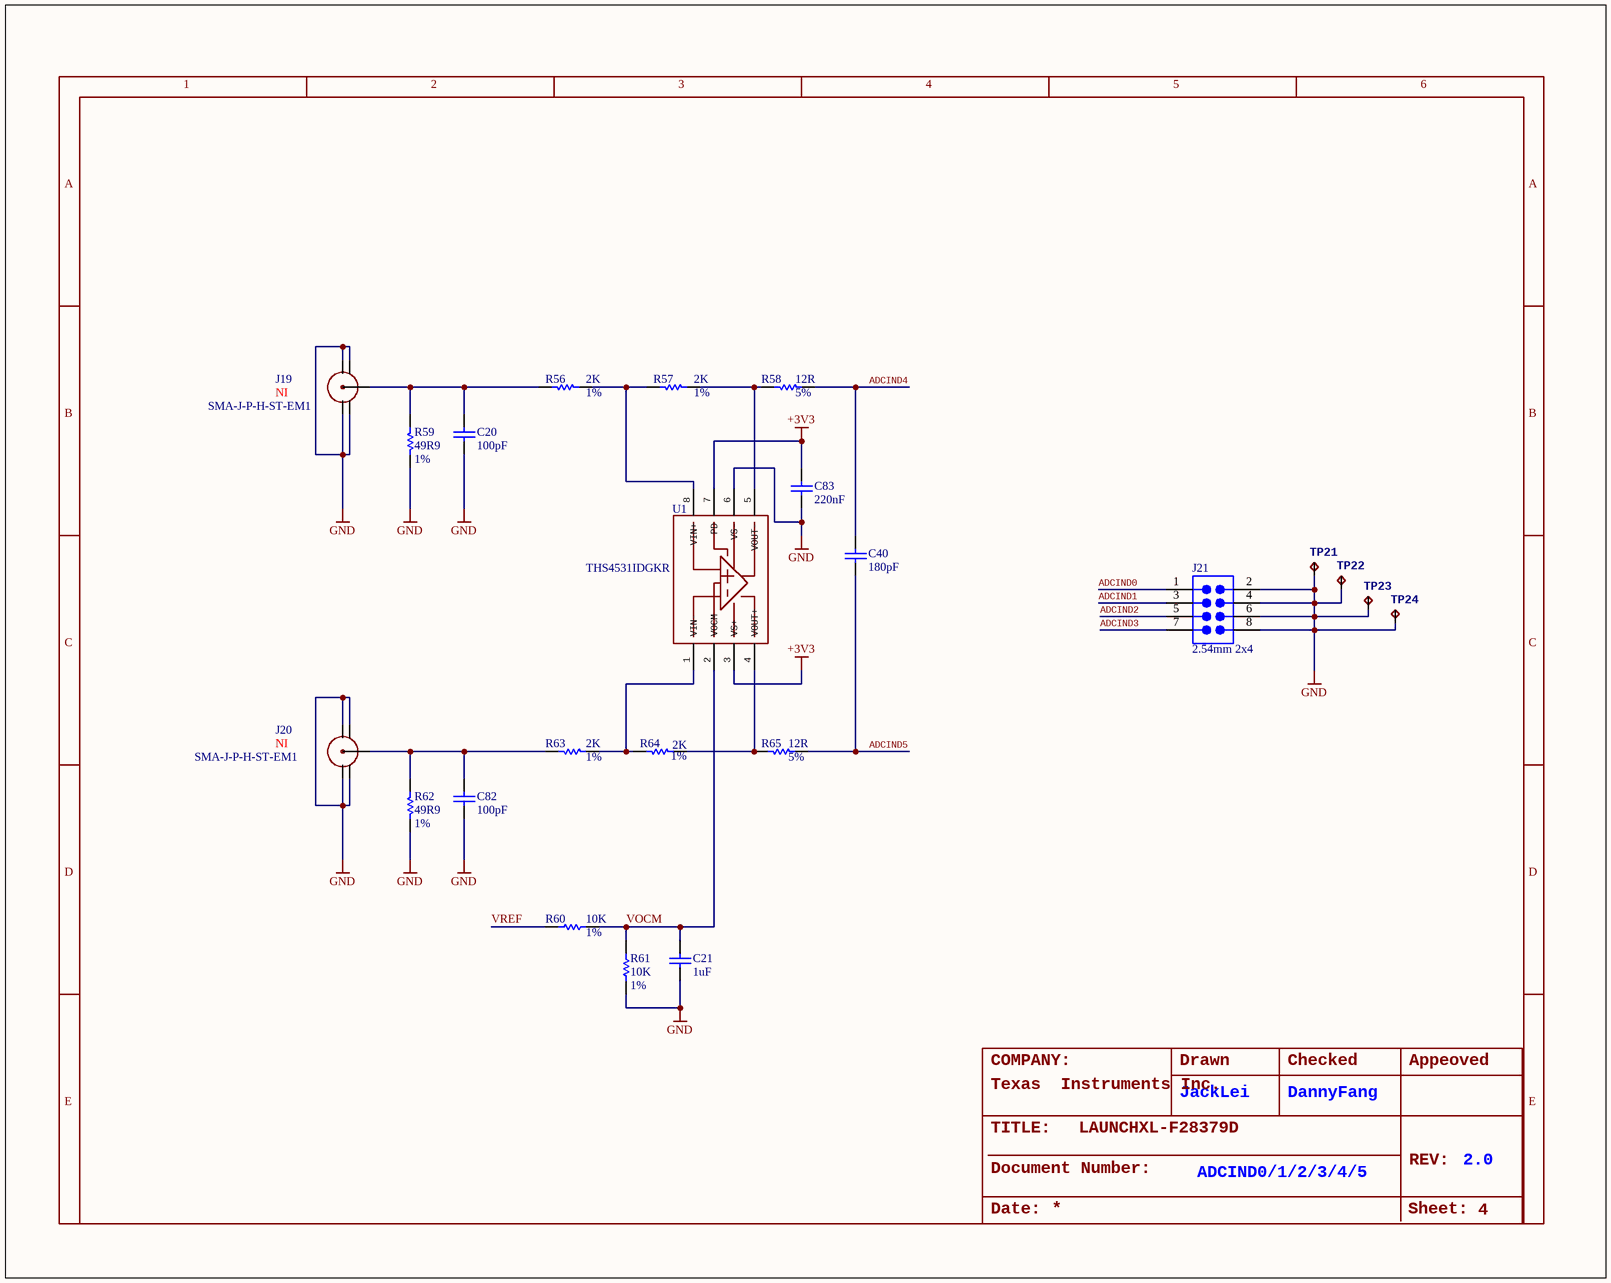
[diagram p3: P04_ADCIND.SchDoc]

### Parts
C20  100pF  [C0402]
C21  1uF  [C0402]
C40  180pF  [C0402]
C82  100pF  [C0402]
C83  220nF  [C0402]
J19  ASSY: NI  [SMA_EM]  (hidden comment: SMA-J-P-H-ST-EM1)
J20  ASSY: NI  [SMA_EM]  (hidden comment: SMA-J-P-H-ST-EM1)
J21  value 2.54mm 2x4  [HDRV8W64P254_2X4_1016X500X854P]  (hidden comment: P101-2*04SGF-116A-NX)
R56  Rating: 1%  [R0402]  (hidden comment: 2K)
R57  Rating: 1%  [R0402]  (hidden comment: 2K)
R58  Rating: 5%  [R0402]  (hidden comment: 12R)
R59  Rating: 1%  [R0402]  (hidden comment: 49R9)
R60  Rating: 1%  [R0402]  (hidden comment: 10K)
R61  Rating: 1%  [R0402]  (hidden comment: 10K)
R62  Rating: 1%  [R0402]  (hidden comment: 49R9)
R63  Rating: 1%  [R0402]  (hidden comment: 2K)
R64  Rating: 1%  [R0402]  (hidden comment: 2K)
R65  Rating: 5%  [R0402]  (hidden comment: 12R)
TP21  TESTPAD_TPB1,27  [TESTPAD_B1,27]  (value not drawn)
TP22  TESTPAD_TPB1,27  [TESTPAD_B1,27]  (value not drawn)
TP23  TESTPAD_TPB1,27  [TESTPAD_B1,27]  (value not drawn)
TP24  TESTPAD_TPB1,27  [TESTPAD_B1,27]  (value not drawn)
U1  THS4531IDGKR  [VSSOP65P490X110-8N]

### Nets
+3V3: C83.2 U1.3(VS+) U1.7(PD)
GND: C20.1 C21.1 C82.1 C83.1 J19.1 J19.3 J19.4 J19.5 J20.1 J20.3 J20.4 J20.5 J21.2 J21.4 J21.6 J21.8 R59.1 R61.2 R62.1 TP21.TP TP22.TP TP23.TP TP24.TP U1.6(VS-)
ADCIND0: J21.1
ADCIND1: J21.3
ADCIND2: J21.5
ADCIND3: J21.7
ADCIND4: C40.2 R58.1
ADCIND5: C40.1 R65.1
VOCM: C21.2 R60.2 R61.1 U1.2(VOCM)
VREF: R60.1
NetC20_2: C20.2 J19.2 R56.2 R59.2
NetC82_2: C82.2 J20.2 R62.2 R63.2
NetR56_1: R56.1 R57.2 U1.8(VIN+)
NetR57_1: R57.1 R58.2 U1.5(VOUT-)
NetR63_1: R63.1 R64.2 U1.1(VIN-)
NetR64_1: R64.1 R65.2 U1.4(VOUT+)

### Notes on the sheet
- COMPANY:
- Texas
  Instruments Inc.
- JackLei
- Drawn
- Checked
- DannyFang
- Appeoved
- TITLE:
- LAUNCHXL-F28379D
- REV:
- 2.0
- Date:
- Document Number:
- ADCIND0/1/2/3/4/5
- Sheet:
- 4
- 1
- 2
- 3
- 5
- 6
- A
- B
- C
- D
- E

### Library data of the parts
C20 C82 = 1004001100017: CAP,100PF,+/-5%,C0G,50V,SMD0402; Manufacturer: MURATA; Manufacturer Part Number: GRM1555C1H101JA01D; Rating: 5%; Embest PN: 1004001100017; Value: 100pF; Part Type: Ceramic Capacitor
C21 = 1004001100056: as C6 on sheet P03_Power; Embest PN: 1004001100056; Value: 1uF; Part Type: Ceramic Capacitor
C40 = 1004001100020: CAP,180PF,+/-5%,C0G,50V,SMD0402; Manufacturer: MURATA; Manufacturer Part Number: GRM1555C1H181JA01D; Rating: 5%; Embest PN: 1004001100020; Value: 180pF; Part Type: Ceramic Capacitor
C83 = 1004001100050: CAP,220NF,+/-10%,X5R,10V,SMD0402; Manufacturer: MURATA; Manufacturer Part Number: GRM155R61A224KE19D; Rating: 10%; Embest PN: 1004001100050; Value: 220nF; Part Type: Ceramic Capacitor
J19 J20 = 1009019100017: RF Connector,SMA Jack, Edge Mount, Gold, Straight, 50Ω,SMD,Tray; Manufacturer: SAMTEC; Embest PN: 1009019100017; Value: SMA-J-P-H-ST-EM1; Part Type: RF Connector; Manufacturer Part Number: SMA-J-P-H-ST-EM1
J21 = 1009001200025: Connector,Pin Header,Straight,Male,2x4Pin,2.54MM pitch,6.06,3.00,Gold Flash 1u, black,DIP; Manufacturer: TOWNES; Embest PN: 1009001200025; Part Type: Pin Header; Manufacturer Part Number: P101-2*04SGF-116A-NX
R56 R57 R63 R64 = 1003001100044: RES,2K,+/-1%,1/16W,SMD0402; Manufacturer: YAGEO; Manufacturer Part Number: RC0402FR-072KL; Embest PN: 1003001100044; Value: 2K; Part Type: Thick film Resistor
R58 R65 = 1003001101032: RES SMD 12 OHM 5% 1/16W 0402 TR; Manufacturer: VISHAY; Manufacturer Part Number: CRCW040212R0JNED; Embest PN: 1003001101032; Value: 12R; Part Type: Thick film Resistor
R59 R62 = 1003001100015: RES,49R9,+/-1%,1/16W,SMD0402; Manufacturer: YAGEO; Manufacturer Part Number: RC0402FR-0749R9L; Embest PN: 1003001100015; Value: 49R9; Part Type: Thick film Resistor
R60 R61 = 1003001100071: as R12 on sheet P02_XDS100v2; Embest PN: 1003001100071; Value: 10K; Part Type: Thick film Resistor
TP21-TP24 = TESTPAD_TPB1,27: Test pad
U1 = 1002007100055C: IC OPAMP DIFF 27MHZ RRO 8VSSOP TR; Manufacturer: TI; Embest PN: 1002007100055C; Value: THS4531IDGKR; Part Type: Amplifier; Manufacturer Part Number: THS4531IDGKR

## Sheet P05_PWM-DAC.SchDoc
size 301 x 239 mm
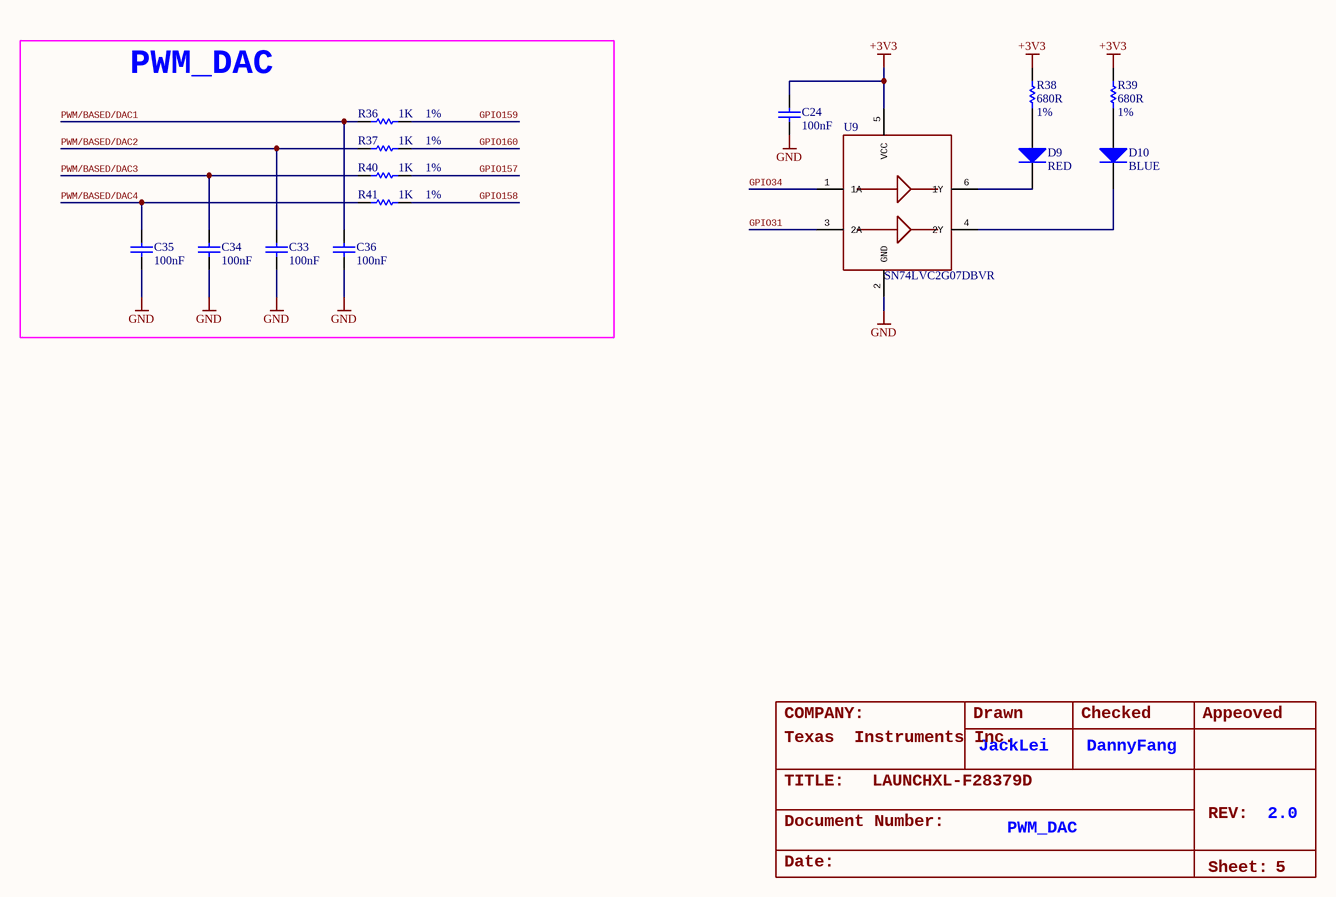
[diagram p4: P05_PWM-DAC.SchDoc]

### Parts
C24  100nF  [C0402]
C33  100nF  [C0402]
C34  100nF  [C0402]
C35  100nF  [C0402]
C36  100nF  [C0402]
D9  value RED  [D0805]  (hidden comment: 150080SS75000)
D10  value BLUE  [D0805]  (hidden comment: 150080BS75000)
R36  Rating: 1%  [R0402]  (hidden comment: 1K)
R37  Rating: 1%  [R0402]  (hidden comment: 1K)
R38  Rating: 1%  [R0402]  (hidden comment: 680R)
R39  Rating: 1%  [R0402]  (hidden comment: 680R)
R40  Rating: 1%  [R0402]  (hidden comment: 1K)
R41  Rating: 1%  [R0402]  (hidden comment: 1K)
U9  SN74LVC2G07DBVR  [SOT23-6]

### Blocks framed on the sheet
PWM_DAC: C33-C36 R36 R37 R40 R41

### Nets
+3V3: C24.2 R38.2 R39.2 U9.5(VCC)
GND: C24.1 C33.1 C34.1 C35.1 C36.1 U9.2(GND)
GPIO31: U9.3(2A)
GPIO34: U9.1(1A)
GPIO157: R40.1
GPIO158: R41.1
GPIO159: R36.1
GPIO160: R37.1
PWM/BASED/DAC1: C36.2 R36.2
PWM/BASED/DAC2: C33.2 R37.2
PWM/BASED/DAC3: C34.2 R40.2
PWM/BASED/DAC4: C35.2 R41.2
NetD9_1: D9.1 U9.6(1Y)
NetD9_2: D9.2 R38.1
NetD10_1: D10.1 U9.4(2Y)
NetD10_2: D10.2 R39.1

### Notes on the sheet
- COMPANY:
- Texas
  Instruments Inc.
- Drawn
- JackLei
- Checked
- DannyFang
- Appeoved
- TITLE:
- LAUNCHXL-F28379D
- REV:
- 2.0
- Date:
- Document Number:
- PWM_DAC
- Sheet:
- 5
- 1
- 2
- 3
- 4
- 6
- A
- B
- C
- D
- E

### Library data of the parts
C24 C33-C36 = 1004001100187: as C12 on sheet P02_XDS100v2; Embest PN: 1004001100187; Value: 100nF; Part Type: Ceramic Capacitor
D9 = 1006001100168: as D8 on sheet P02_XDS100v2; Embest PN: 1006001100168; Part Type: LED; Manufacturer Part Number: 150080SS75000
D10 = 1006001100167: as D7 on sheet P02_XDS100v2; Embest PN: 1006001100167; Part Type: LED; Manufacturer Part Number: 150080BS75000
R36 R37 R40 R41 = 1003001100034: as R22 on sheet P02_XDS100v2; Embest PN: 1003001100034; Value: 1K; Part Type: Thick film Resistor
R38 R39 = 1003001100490: as R26 on sheet P02_XDS100v2; Embest PN: 1003001100490; Value: 680R; Part Type: Thick film Resistor
U9 = 1002008100102C: Buffer/Driver 2-CH Non-Inverting Open Drain CMOS 6-Pin SOT-23 T/R,CUSTOMER SUPPLY; Manufacturer: TI; Embest PN: 1002008100102C; Value: SN74LVC2G07DBVR; Part Type: Logic; Manufacturer Part Number: SN74LVC2G07DBVR

## Sheet P07_F28379D-PWR.SchDoc
size 301 x 239 mm
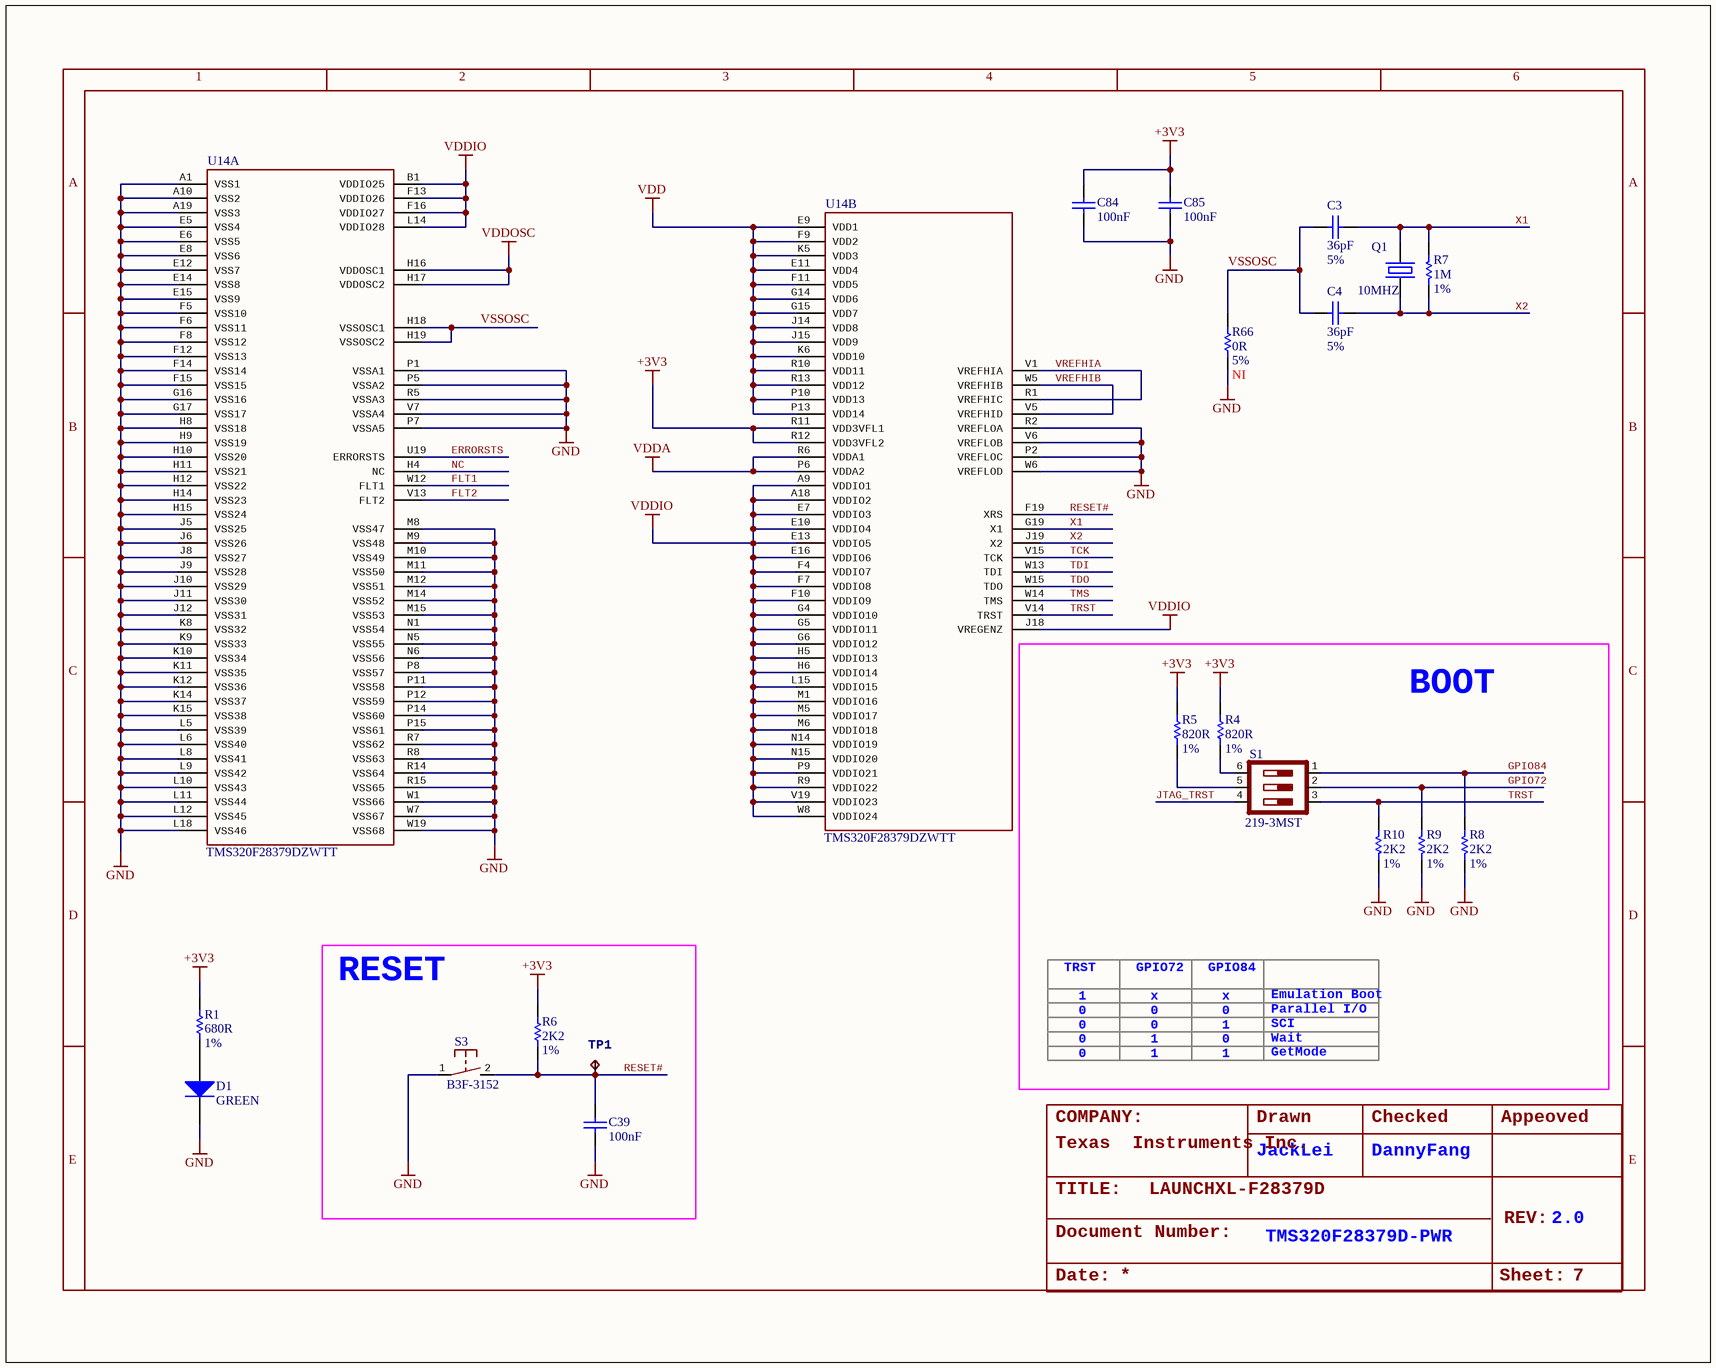
[diagram p5: P07_F28379D-PWR.SchDoc]

### Parts
C3  Rating: 5%  [C0402]  (hidden comment: 36pF)
C4  Rating: 5%  [C0402]  (hidden comment: 36pF)
C39  100nF  [C0402]
C84  100nF  [C0402]
C85  100nF  [C0402]
D1  value GREEN  [D0805]  (hidden comment: 150080VS75000)
Q1  value 10MHZ  [OSC488P1105X465X350-2N]  (hidden comment: ATS100B-E)
R1  Rating: 1%  [R0402]  (hidden comment: 680R)
R4  Rating: 1%  [R0402]  (hidden comment: 820R)
R5  Rating: 1%  [R0402]  (hidden comment: 820R)
R6  Rating: 1%  [R0402]  (hidden comment: 2K2)
R7  Rating: 1%  [R0402]  (hidden comment: 1M)
R8  Rating: 1%  [R0402]  (hidden comment: 2K2)
R9  Rating: 1%  [R0402]  (hidden comment: 2K2)
R10  Rating: 1%  [R0402]  (hidden comment: 2K2)
R66  Rating: 5%  ASSY: NI  [R0402]  (hidden comment: 0R)
S1  219-3MST  [SW254P990X385-6N]
S3  B3F-3152  [SW4P730X625]
TP1  TESTPAD_TPB1,27  [TESTPAD_B1,27]  (value not drawn)
U14  TMS320F28379DZWTT  [BGA337C80P19X19_1600X1600X140]  (parts A,B of 5)

### Blocks framed on the sheet
BOOT: R4 R5 R8-R10 S1
RESET: C39 R6 S3 TP1

### Nets
+3V3: C84.1 C85.1 R1.2 R4.2 R5.2 R6.2 U14.R11(VDD3VFL1) U14.R12(VDD3VFL2)
GND: C39.2 C84.2 C85.2 D1.1 R8.1 R9.1 R10.1 R66.2 S3.1(P) U14.A1(VSS1) U14.A10(VSS2) U14.A19(VSS3) U14.E5(VSS4) U14.E6(VSS5) U14.E8(VSS6) U14.E12(VSS7) U14.E14(VSS8) U14.E15(VSS9) U14.F5(VSS10) U14.F6(VSS11) U14.F8(VSS12) U14.F12(VSS13) U14.F14(VSS14) U14.F15(VSS15) U14.G16(VSS16) U14.G17(VSS17) U14.H8(VSS18) U14.H9(VSS19) U14.H10(VSS20) U14.H11(VSS21) U14.H12(VSS22) U14.H14(VSS23) U14.H15(VSS24) U14.J5(VSS25) U14.J6(VSS26) U14.J8(VSS27) U14.J9(VSS28) U14.J10(VSS29) U14.J11(VSS30) U14.J12(VSS31) U14.K8(VSS32) U14.K9(VSS33) U14.K10(VSS34) U14.K11(VSS35) U14.K12(VSS36) U14.K14(VSS37) U14.K15(VSS38) U14.L5(VSS39) U14.L6(VSS40) U14.L8(VSS41) U14.L9(VSS42) U14.L10(VSS43) U14.L11(VSS44) U14.L12(VSS45) U14.L18(VSS46) U14.M8(VSS47) U14.M9(VSS48) U14.M10(VSS49) U14.M11(VSS50) U14.M12(VSS51) U14.M14(VSS52) U14.M15(VSS53) U14.N1(VSS54) U14.N5(VSS55) U14.N6(VSS56) U14.P1(VSSA1) U14.P2(VREFLOC) U14.P5(VSSA2) U14.P7(VSSA5) U14.P8(VSS57) U14.P11(VSS58) U14.P12(VSS59) U14.P14(VSS60) U14.P15(VSS61) U14.R2(VREFLOA) U14.R5(VSSA3) U14.R7(VSS62) U14.R8(VSS63) U14.R14(VSS64) U14.R15(VSS65) U14.V6(VREFLOB) U14.V7(VSSA4) U14.W1(VSS66) U14.W6(VREFLOD) U14.W7(VSS67) U14.W19(VSS68)
VDD: U14.E9(VDD1) U14.E11(VDD4) U14.F9(VDD2) U14.F11(VDD5) U14.G14(VDD6) U14.G15(VDD7) U14.J14(VDD8) U14.J15(VDD9) U14.K5(VDD3) U14.K6(VDD10) U14.P10(VDD13) U14.P13(VDD14) U14.R10(VDD11) U14.R13(VDD12)
VDDA: U14.P6(VDDA2) U14.R6(VDDA1)
VDDIO: U14.A9(VDDIO1) U14.A18(VDDIO2) U14.B1(VDDIO25) U14.E7(VDDIO3) U14.E10(VDDIO4) U14.E13(VDDIO5) U14.E16(VDDIO6) U14.F4(VDDIO7) U14.F7(VDDIO8) U14.F10(VDDIO9) U14.F13(VDDIO26) U14.F16(VDDIO27) U14.G4(VDDIO10) U14.G5(VDDIO11) U14.G6(VDDIO12) U14.H5(VDDIO13) U14.H6(VDDIO14) U14.J18(VREGENZ) U14.L14(VDDIO28) U14.L15(VDDIO15) U14.M1(VDDIO16) U14.M5(VDDIO17) U14.M6(VDDIO18) U14.N14(VDDIO19) U14.N15(VDDIO20) U14.P9(VDDIO21) U14.R9(VDDIO22) U14.V19(VDDIO23) U14.W8(VDDIO24)
VDDOSC: U14.H16(VDDOSC1) U14.H17(VDDOSC2)
ERRORSTS: U14.U19(ERRORSTS)
FLT1: U14.W12(FLT1)
FLT2: U14.V13(FLT2)
GPIO72: R9.2 S1.2
GPIO84: R8.2 S1.1
JTAG_TRST: S1.4
NC: U14.H4(NC)
RESET#: C39.1 R6.1 S3.2(S) TP1.TP U14.F19(XRS)
TCK: U14.V15(TCK)
TDI: U14.W13(TDI)
TDO: U14.W15(TDO)
TMS: U14.W14(TMS)
TRST: R10.2 S1.3 U14.V14(TRST)
VREFHIA: U14.R1(VREFHIC) U14.V1(VREFHIA)
VREFHIB: U14.V5(VREFHID) U14.W5(VREFHIB)
VSSOSC: C3.2 C4.2 R66.1 U14.H18(VSSOSC1) U14.H19(VSSOSC2)
X1: C3.1 Q1.2 R7.2 U14.G19(X1)
X2: C4.1 Q1.1 R7.1 U14.J19(X2)
NetD1_2: D1.2 R1.1
NetR4_1: R4.1 S1.6
NetR5_1: R5.1 S1.5

### Notes on the sheet
- TRST
- 1
- 0
- GPIO72
- x
- GPIO84
- Emulation Boot
- Parallel I/O
- SCI
- Wait
- GetMode
- COMPANY:
- Texas
  Instruments Inc.
- JackLei
- Drawn
- Checked
- DannyFang
- Appeoved
- TITLE:
- Document Number:
- LAUNCHXL-F28379D
- TMS320F28379D-PWR
- REV:
- 2.0
- Date:
- Sheet:
- 7
- 2
- 3
- 4
- 5
- 6
- A
- B
- C
- D
- E

### Library data of the parts
C3 C4 = 1004001100255: as C17 on sheet P02_XDS100v2; Embest PN: 1004001100255; Value: 36pF; Part Type: Ceramic Capacitor
C39 C84 C85 = 1004001100187: as C12 on sheet P02_XDS100v2; Embest PN: 1004001100187; Value: 100nF; Part Type: Ceramic Capacitor
D1 = 1006001100166: as D4 on sheet P02_XDS100v2; Embest PN: 1006001100166; Part Type: LED; Manufacturer Part Number: 150080VS75000
Q1 = 1008002200125: Crystal 10.0000MHz 30ppm 18pF 60 Ohm -40°C - 85°C Through Hole HC49/US; Manufacturer: CTS; Embest PN: 1008002200125; Part Type: Crystal; Manufacturer Part Number: ATS100B-E
R1 = 1003001100490: as R26 on sheet P02_XDS100v2; Embest PN: 1003001100490; Value: 680R; Part Type: Thick film Resistor
R4 R5 = 1003001100482: RES,820R,+/-1%,1/16W,SMD0402; Manufacturer: YAGEO; Manufacturer Part Number: RC0402FR-07820RL; Embest PN: 1003001100482; Value: 820R; Part Type: Thick film Resistor
R6 R8-R10 = 1003001100045: as R31 on sheet P02_XDS100v2; Embest PN: 1003001100045; Value: 2K2; Part Type: Thick film Resistor
R7 = 1003001100155: RES,1M,+/-1%,1/16W,SMD0402; Manufacturer: YAGEO; Manufacturer Part Number: RC0402FR-071ML; Embest PN: 1003001100155; Value: 1M; Part Type: Thick film Resistor
R66 = 1003001100001: as R15 on sheet P02_XDS100v2; Embest PN: 1003001100001; Value: 0R; Part Type: Thick film Resistor
S1 = 1010003100003: Switch, DIP Switches,3 Position,2.54MM Pitch,black housing,white plunger,SMD; Manufacturer: CTS; Embest PN: 1010003100003; Value: 219-3MST; Part Type: DIP Switch; Manufacturer Part Number: 219-3MST
S3 = 1010001200049: SWITCH TACTILE SPST-NO 0.05A 24V; Manufacturer: OMRON; Embest PN: 1010001200049; Value: B3F-3152; Part Type: Tactile Switch; Manufacturer Part Number: B3F-3152
TP1 = TESTPAD_TPB1,27: Test pad
U14 = 1002002100202C: IC, MCU 32BIT 1024KB,TMS320F28379DZWTT,BGA-337,SMD,customer supply; Manufacturer: TI; Embest PN: 1002002100202C; Value: TMS320F28379DZWTT; Part Type: MCU; Manufacturer Part Number: TMS320F28379DZWTT

## Sheet P08_F28379D-IO1.SchDoc
size 301 x 239 mm
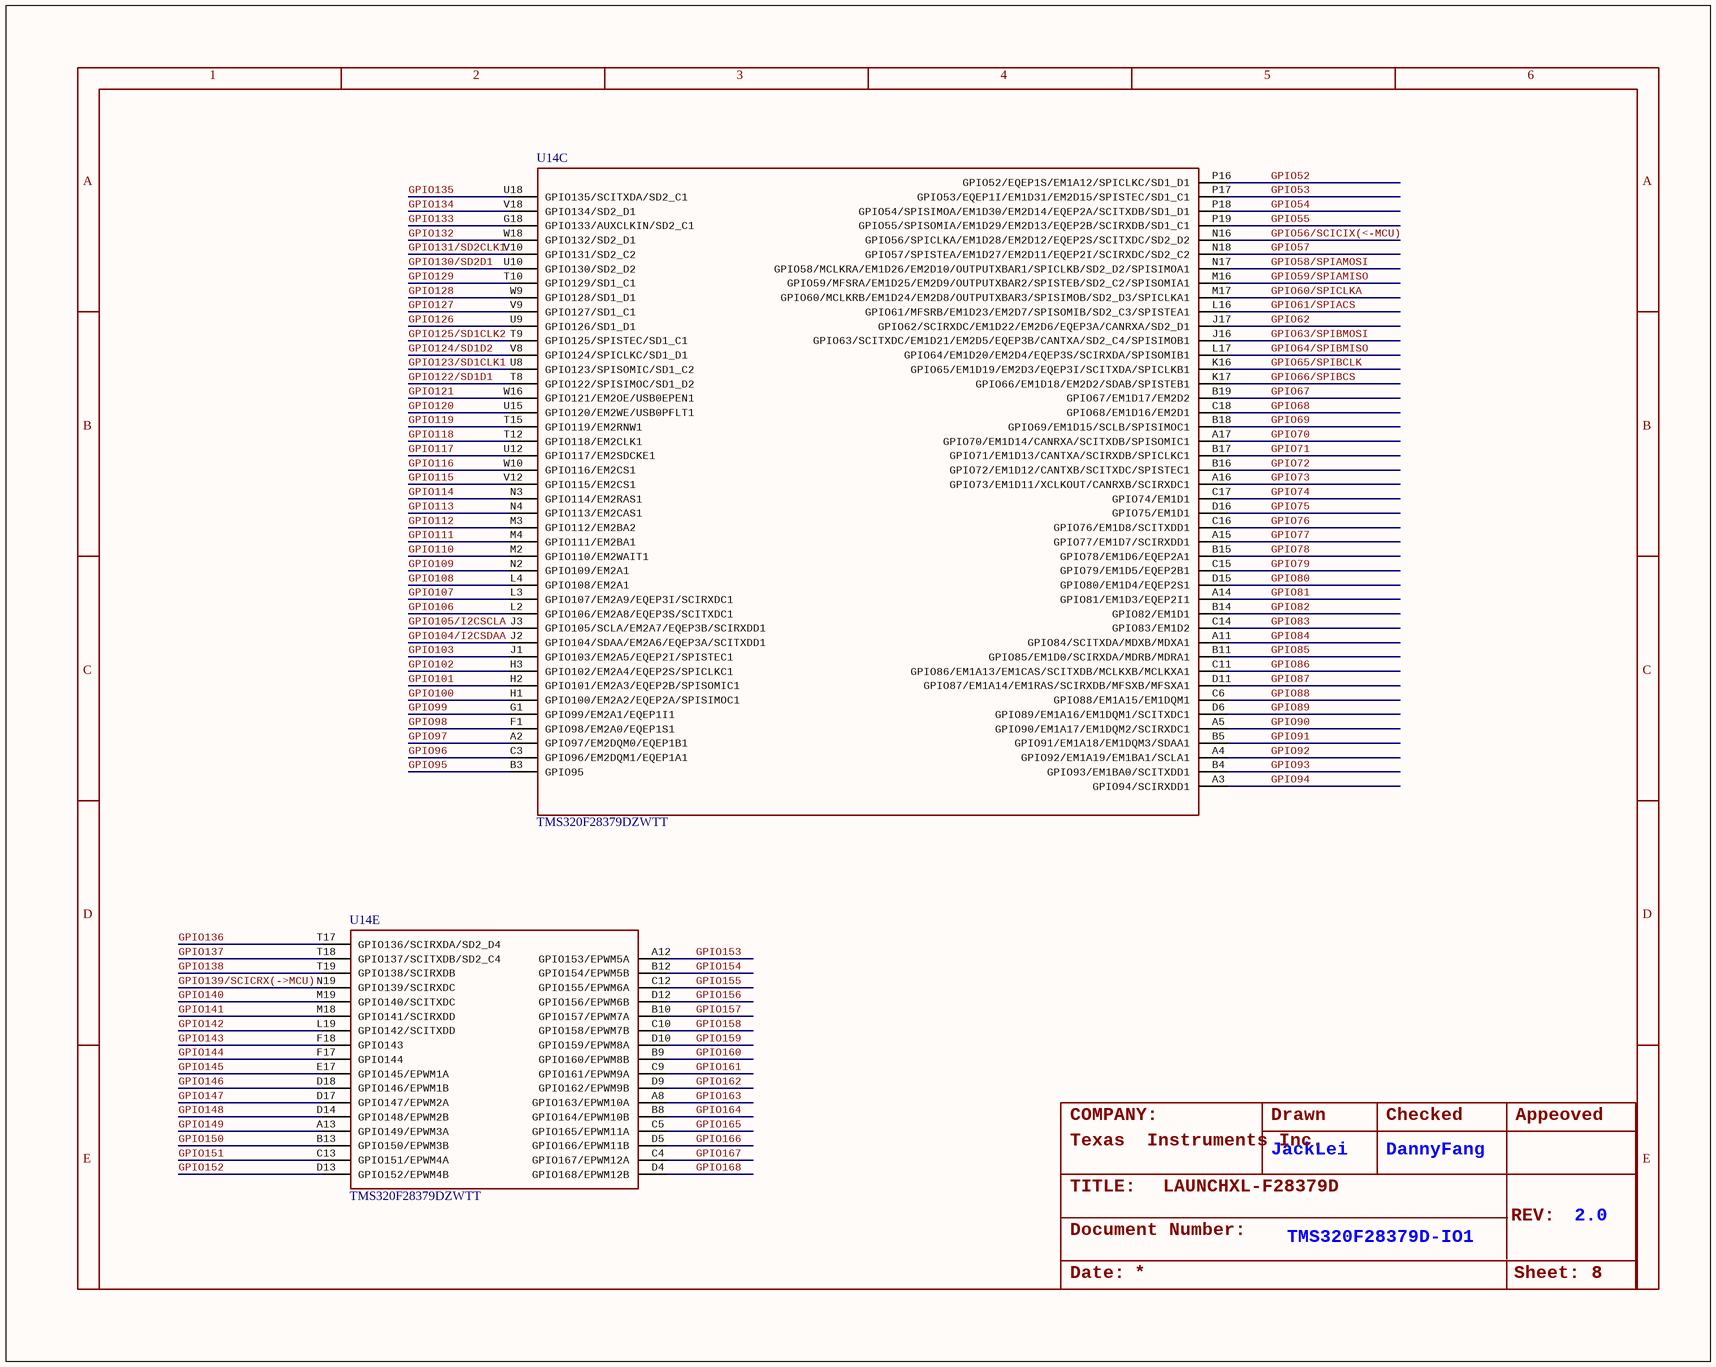
[diagram p6: P08_F28379D-IO1.SchDoc]

### Parts
U14  TMS320F28379DZWTT  [BGA337C80P19X19_1600X1600X140]  (parts C,E of 5)

### Nets
GPIO52: U14.P16(GPIO52/EQEP1S/EM1A12/SPICLKC/SD1_D1)
GPIO53: U14.P17(GPIO53/EQEP1I/EM1D31/EM2D15/SPISTEC/SD1_C1)
GPIO54: U14.P18(GPIO54/SPISIMOA/EM1D30/EM2D14/EQEP2A/SCITXDB/SD1_D1)
GPIO55: U14.P19(GPIO55/SPISOMIA/EM1D29/EM2D13/EQEP2B/SCIRXDB/SD1_C1)
GPIO56/SCICIX(<-MCU): U14.N16(GPIO56/SPICLKA/EM1D28/EM2D12/EQEP2S/SCITXDC/SD2_D2)
GPIO57: U14.N18(GPIO57/SPISTEA/EM1D27/EM2D11/EQEP2I/SCIRXDC/SD2_C2)
GPIO58/SPIAMOSI: U14.N17(GPIO58/MCLKRA/EM1D26/EM2D10/OUTPUTXBAR1/SPICLKB/SD2_D2/SPISIMOA1)
GPIO59/SPIAMISO: U14.M16(GPIO59/MFSRA/EM1D25/EM2D9/OUTPUTXBAR2/SPISTEB/SD2_C2/SPISOMIA1)
GPIO60/SPICLKA: U14.M17(GPIO60/MCLKRB/EM1D24/EM2D8/OUTPUTXBAR3/SPISIMOB/SD2_D3/SPICLKA1)
GPIO61/SPIACS: U14.L16(GPIO61/MFSRB/EM1D23/EM2D7/SPISOMIB/SD2_C3/SPISTEA1)
GPIO62: U14.J17(GPIO62/SCIRXDC/EM1D22/EM2D6/EQEP3A/CANRXA/SD2_D1)
GPIO63/SPIBMOSI: U14.J16(GPIO63/SCITXDC/EM1D21/EM2D5/EQEP3B/CANTXA/SD2_C4/SPISIMOB1)
GPIO64/SPIBMISO: U14.L17(GPIO64/EM1D20/EM2D4/EQEP3S/SCIRXDA/SPISOMIB1)
GPIO65/SPIBCLK: U14.K16(GPIO65/EM1D19/EM2D3/EQEP3I/SCITXDA/SPICLKB1)
GPIO66/SPIBCS: U14.K17(GPIO66/EM1D18/EM2D2/SDAB/SPISTEB1)
GPIO67: U14.B19(GPIO67/EM1D17/EM2D2)
GPIO68: U14.C18(GPIO68/EM1D16/EM2D1)
GPIO69: U14.B18(GPIO69/EM1D15/SCLB/SPISIMOC1)
GPIO70: U14.A17(GPIO70/EM1D14/CANRXA/SCITXDB/SPISOMIC1)
GPIO71: U14.B17(GPIO71/EM1D13/CANTXA/SCIRXDB/SPICLKC1)
GPIO72: U14.B16(GPIO72/EM1D12/CANTXB/SCITXDC/SPISTEC1)
GPIO73: U14.A16(GPIO73/EM1D11/XCLKOUT/CANRXB/SCIRXDC1)
GPIO74: U14.C17(GPIO74/EM1D1)
GPIO75: U14.D16(GPIO75/EM1D1)
GPIO76: U14.C16(GPIO76/EM1D8/SCITXDD1)
GPIO77: U14.A15(GPIO77/EM1D7/SCIRXDD1)
GPIO78: U14.B15(GPIO78/EM1D6/EQEP2A1)
GPIO79: U14.C15(GPIO79/EM1D5/EQEP2B1)
GPIO80: U14.D15(GPIO80/EM1D4/EQEP2S1)
GPIO81: U14.A14(GPIO81/EM1D3/EQEP2I1)
GPIO82: U14.B14(GPIO82/EM1D1)
GPIO83: U14.C14(GPIO83/EM1D2)
GPIO84: U14.A11(GPIO84/SCITXDA/MDXB/MDXA1)
GPIO85: U14.B11(GPIO85/EM1D0/SCIRXDA/MDRB/MDRA1)
GPIO86: U14.C11(GPIO86/EM1A13/EM1CAS/SCITXDB/MCLKXB/MCLKXA1)
GPIO87: U14.D11(GPIO87/EM1A14/EM1RAS/SCIRXDB/MFSXB/MFSXA1)
GPIO88: U14.C6(GPIO88/EM1A15/EM1DQM1)
GPIO89: U14.D6(GPIO89/EM1A16/EM1DQM1/SCITXDC1)
GPIO90: U14.A5(GPIO90/EM1A17/EM1DQM2/SCIRXDC1)
GPIO91: U14.B5(GPIO91/EM1A18/EM1DQM3/SDAA1)
GPIO92: U14.A4(GPIO92/EM1A19/EM1BA1/SCLA1)
GPIO93: U14.B4(GPIO93/EM1BA0/SCITXDD1)
GPIO94: U14.A3(GPIO94/SCIRXDD1)
GPIO95: U14.B3(GPIO95)
GPIO96: U14.C3(GPIO96/EM2DQM1/EQEP1A1)
GPIO97: U14.A2(GPIO97/EM2DQM0/EQEP1B1)
GPIO98: U14.F1(GPIO98/EM2A0/EQEP1S1)
GPIO99: U14.G1(GPIO99/EM2A1/EQEP1I1)
GPIO100: U14.H1(GPIO100/EM2A2/EQEP2A/SPISIMOC1)
GPIO101: U14.H2(GPIO101/EM2A3/EQEP2B/SPISOMIC1)
GPIO102: U14.H3(GPIO102/EM2A4/EQEP2S/SPICLKC1)
GPIO103: U14.J1(GPIO103/EM2A5/EQEP2I/SPISTEC1)
GPIO104/I2CSDAA: U14.J2(GPIO104/SDAA/EM2A6/EQEP3A/SCITXDD1)
GPIO105/I2CSCLA: U14.J3(GPIO105/SCLA/EM2A7/EQEP3B/SCIRXDD1)
GPIO106: U14.L2(GPIO106/EM2A8/EQEP3S/SCITXDC1)
GPIO107: U14.L3(GPIO107/EM2A9/EQEP3I/SCIRXDC1)
GPIO108: U14.L4(GPIO108/EM2A1)
GPIO109: U14.N2(GPIO109/EM2A1)
GPIO110: U14.M2(GPIO110/EM2WAIT1)
GPIO111: U14.M4(GPIO111/EM2BA1)
GPIO112: U14.M3(GPIO112/EM2BA2)
GPIO113: U14.N4(GPIO113/EM2CAS1)
GPIO114: U14.N3(GPIO114/EM2RAS1)
GPIO115: U14.V12(GPIO115/EM2CS1)
GPIO116: U14.W10(GPIO116/EM2CS1)
GPIO117: U14.U12(GPIO117/EM2SDCKE1)
GPIO118: U14.T12(GPIO118/EM2CLK1)
GPIO119: U14.T15(GPIO119/EM2RNW1)
GPIO120: U14.U15(GPIO120/EM2WE/USB0PFLT1)
GPIO121: U14.W16(GPIO121/EM2OE/USB0EPEN1)
GPIO122/SD1D1: U14.T8(GPIO122/SPISIMOC/SD1_D2)
GPIO123/SD1CLK1: U14.U8(GPIO123/SPISOMIC/SD1_C2)
GPIO124/SD1D2: U14.V8(GPIO124/SPICLKC/SD1_D1)
GPIO125/SD1CLK2: U14.T9(GPIO125/SPISTEC/SD1_C1)
GPIO126: U14.U9(GPIO126/SD1_D1)
GPIO127: U14.V9(GPIO127/SD1_C1)
GPIO128: U14.W9(GPIO128/SD1_D1)
GPIO129: U14.T10(GPIO129/SD1_C1)
GPIO130/SD2D1: U14.U10(GPIO130/SD2_D2)
GPIO131/SD2CLK1: U14.V10(GPIO131/SD2_C2)
GPIO132: U14.W18(GPIO132/SD2_D1)
GPIO133: U14.G18(GPIO133/AUXCLKIN/SD2_C1)
GPIO134: U14.V18(GPIO134/SD2_D1)
GPIO135: U14.U18(GPIO135/SCITXDA/SD2_C1)
GPIO136: U14.T17(GPIO136/SCIRXDA/SD2_D4)
GPIO137: U14.T18(GPIO137/SCITXDB/SD2_C4)
GPIO138: U14.T19(GPIO138/SCIRXDB)
GPIO139/SCICRX(->MCU): U14.N19(GPIO139/SCIRXDC)
GPIO140: U14.M19(GPIO140/SCITXDC)
GPIO141: U14.M18(GPIO141/SCIRXDD)
GPIO142: U14.L19(GPIO142/SCITXDD)
GPIO143: U14.F18(GPIO143)
GPIO144: U14.F17(GPIO144)
GPIO145: U14.E17(GPIO145/EPWM1A)
GPIO146: U14.D18(GPIO146/EPWM1B)
GPIO147: U14.D17(GPIO147/EPWM2A)
GPIO148: U14.D14(GPIO148/EPWM2B)
GPIO149: U14.A13(GPIO149/EPWM3A)
GPIO150: U14.B13(GPIO150/EPWM3B)
GPIO151: U14.C13(GPIO151/EPWM4A)
GPIO152: U14.D13(GPIO152/EPWM4B)
GPIO153: U14.A12(GPIO153/EPWM5A)
GPIO154: U14.B12(GPIO154/EPWM5B)
GPIO155: U14.C12(GPIO155/EPWM6A)
GPIO156: U14.D12(GPIO156/EPWM6B)
GPIO157: U14.B10(GPIO157/EPWM7A)
GPIO158: U14.C10(GPIO158/EPWM7B)
GPIO159: U14.D10(GPIO159/EPWM8A)
GPIO160: U14.B9(GPIO160/EPWM8B)
GPIO161: U14.C9(GPIO161/EPWM9A)
GPIO162: U14.D9(GPIO162/EPWM9B)
GPIO163: U14.A8(GPIO163/EPWM10A)
GPIO164: U14.B8(GPIO164/EPWM10B)
GPIO165: U14.C5(GPIO165/EPWM11A)
GPIO166: U14.D5(GPIO166/EPWM11B)
GPIO167: U14.C4(GPIO167/EPWM12A)
GPIO168: U14.D4(GPIO168/EPWM12B)

### Notes on the sheet
- COMPANY:
- Texas
  Instruments Inc.
- JackLei
- Drawn
- Checked
- DannyFang
- Appeoved
- TITLE:
- Document Number:
- LAUNCHXL-F28379D
- TMS320F28379D-IO1
- REV:
- 2.0
- Date:
- Sheet:
- 8
- 1
- 2
- 3
- 4
- 5
- 6
- A
- B
- C
- D
- E

### Library data of the parts
U14 = 1002002100202C: as U14 on sheet P07_F28379D-PWR; Embest PN: 1002002100202C; Value: TMS320F28379DZWTT; Part Type: MCU; Manufacturer Part Number: TMS320F28379DZWTT

## Sheet P09_F28379D-IO2.SchDoc
size 301 x 239 mm
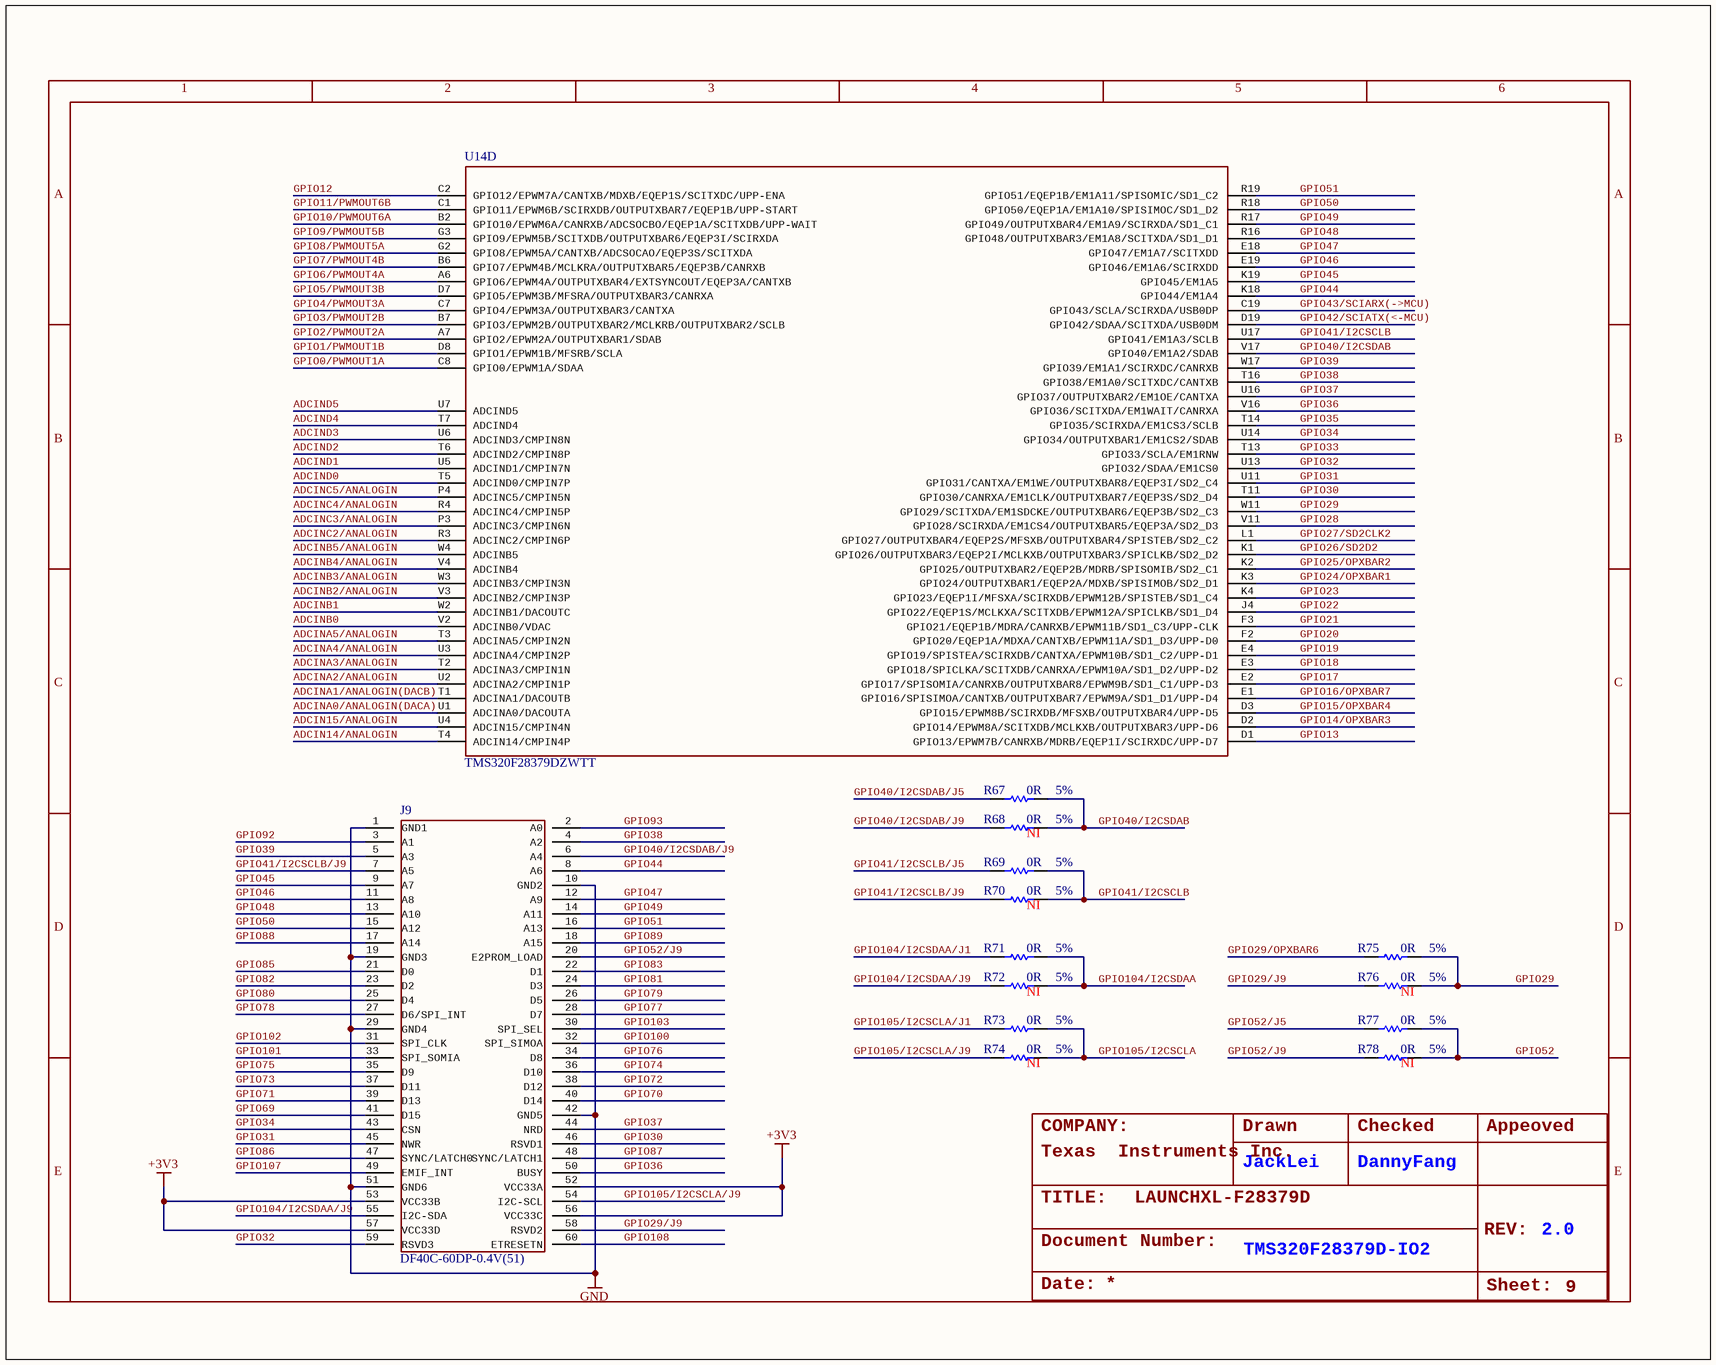
[diagram p7: P09_F28379D-IO2.SchDoc]

### Parts
J9  DF40C-60DP-0.4V(51)  [BTB60P40_2X30_1152X297X114P]
R67  Rating: 5%  [R0603]  (hidden comment: 0R)
R68  Rating: 5%  ASSY: NI  [R0603]  (hidden comment: 0R)
R69  Rating: 5%  [R0603]  (hidden comment: 0R)
R70  Rating: 5%  ASSY: NI  [R0603]  (hidden comment: 0R)
R71  Rating: 5%  [R0603]  (hidden comment: 0R)
R72  Rating: 5%  ASSY: NI  [R0603]  (hidden comment: 0R)
R73  Rating: 5%  [R0603]  (hidden comment: 0R)
R74  Rating: 5%  ASSY: NI  [R0603]  (hidden comment: 0R)
R75  Rating: 5%  [R0603]  (hidden comment: 0R)
R76  Rating: 5%  ASSY: NI  [R0603]  (hidden comment: 0R)
R77  Rating: 5%  [R0603]  (hidden comment: 0R)
R78  Rating: 5%  ASSY: NI  [R0603]  (hidden comment: 0R)
U14  TMS320F28379DZWTT  [BGA337C80P19X19_1600X1600X140]  (part D of 5)

### Nets
+3V3: J9.52(VCC33A) J9.53(VCC33B) J9.56(VCC33C) J9.57(VCC33D)
GND: J9.1(GND1) J9.10(GND2) J9.19(GND3) J9.29(GND4) J9.42(GND5) J9.51(GND6)
ADCIN14/ANALOGIN: U14.T4(ADCIN14/CMPIN4P)
ADCIN15/ANALOGIN: U14.U4(ADCIN15/CMPIN4N)
ADCINA0/ANALOGIN(DACA): U14.U1(ADCINA0/DACOUTA)
ADCINA1/ANALOGIN(DACB): U14.T1(ADCINA1/DACOUTB)
ADCINA2/ANALOGIN: U14.U2(ADCINA2/CMPIN1P)
ADCINA3/ANALOGIN: U14.T2(ADCINA3/CMPIN1N)
ADCINA4/ANALOGIN: U14.U3(ADCINA4/CMPIN2P)
ADCINA5/ANALOGIN: U14.T3(ADCINA5/CMPIN2N)
ADCINB0: U14.V2(ADCINB0/VDAC)
ADCINB1: U14.W2(ADCINB1/DACOUTC)
ADCINB2/ANALOGIN: U14.V3(ADCINB2/CMPIN3P)
ADCINB3/ANALOGIN: U14.W3(ADCINB3/CMPIN3N)
ADCINB4/ANALOGIN: U14.V4(ADCINB4)
ADCINB5/ANALOGIN: U14.W4(ADCINB5)
ADCINC2/ANALOGIN: U14.R3(ADCINC2/CMPIN6P)
ADCINC3/ANALOGIN: U14.P3(ADCINC3/CMPIN6N)
ADCINC4/ANALOGIN: U14.R4(ADCINC4/CMPIN5P)
ADCINC5/ANALOGIN: U14.P4(ADCINC5/CMPIN5N)
ADCIND0: U14.T5(ADCIND0/CMPIN7P)
ADCIND1: U14.U5(ADCIND1/CMPIN7N)
ADCIND2: U14.T6(ADCIND2/CMPIN8P)
ADCIND3: U14.U6(ADCIND3/CMPIN8N)
ADCIND4: U14.T7(ADCIND4)
ADCIND5: U14.U7(ADCIND5)
GPIO0/PWMOUT1A: U14.C8(GPIO0/EPWM1A/SDAA)
GPIO1/PWMOUT1B: U14.D8(GPIO1/EPWM1B/MFSRB/SCLA)
GPIO2/PWMOUT2A: U14.A7(GPIO2/EPWM2A/OUTPUTXBAR1/SDAB)
GPIO3/PWMOUT2B: U14.B7(GPIO3/EPWM2B/OUTPUTXBAR2/MCLKRB/OUTPUTXBAR2/SCLB)
GPIO4/PWMOUT3A: U14.C7(GPIO4/EPWM3A/OUTPUTXBAR3/CANTXA)
GPIO5/PWMOUT3B: U14.D7(GPIO5/EPWM3B/MFSRA/OUTPUTXBAR3/CANRXA)
GPIO6/PWMOUT4A: U14.A6(GPIO6/EPWM4A/OUTPUTXBAR4/EXTSYNCOUT/EQEP3A/CANTXB)
GPIO7/PWMOUT4B: U14.B6(GPIO7/EPWM4B/MCLKRA/OUTPUTXBAR5/EQEP3B/CANRXB)
GPIO8/PWMOUT5A: U14.G2(GPIO8/EPWM5A/CANTXB/ADCSOCAO/EQEP3S/SCITXDA)
GPIO9/PWMOUT5B: U14.G3(GPIO9/EPWM5B/SCITXDB/OUTPUTXBAR6/EQEP3I/SCIRXDA)
GPIO10/PWMOUT6A: U14.B2(GPIO10/EPWM6A/CANRXB/ADCSOCBO/EQEP1A/SCITXDB/UPP-WAIT)
GPIO11/PWMOUT6B: U14.C1(GPIO11/EPWM6B/SCIRXDB/OUTPUTXBAR7/EQEP1B/UPP-START)
GPIO12: U14.C2(GPIO12/EPWM7A/CANTXB/MDXB/EQEP1S/SCITXDC/UPP-ENA)
GPIO13: U14.D1(GPIO13/EPWM7B/CANRXB/MDRB/EQEP1I/SCIRXDC/UPP-D7)
GPIO14/OPXBAR3: U14.D2(GPIO14/EPWM8A/SCITXDB/MCLKXB/OUTPUTXBAR3/UPP-D6)
GPIO15/OPXBAR4: U14.D3(GPIO15/EPWM8B/SCIRXDB/MFSXB/OUTPUTXBAR4/UPP-D5)
GPIO16/OPXBAR7: U14.E1(GPIO16/SPISIMOA/CANTXB/OUTPUTXBAR7/EPWM9A/SD1_D1/UPP-D4)
GPIO17: U14.E2(GPIO17/SPISOMIA/CANRXB/OUTPUTXBAR8/EPWM9B/SD1_C1/UPP-D3)
GPIO18: U14.E3(GPIO18/SPICLKA/SCITXDB/CANRXA/EPWM10A/SD1_D2/UPP-D2)
GPIO19: U14.E4(GPIO19/SPISTEA/SCIRXDB/CANTXA/EPWM10B/SD1_C2/UPP-D1)
GPIO20: U14.F2(GPIO20/EQEP1A/MDXA/CANTXB/EPWM11A/SD1_D3/UPP-D0)
GPIO21: U14.F3(GPIO21/EQEP1B/MDRA/CANRXB/EPWM11B/SD1_C3/UPP-CLK)
GPIO22: U14.J4(GPIO22/EQEP1S/MCLKXA/SCITXDB/EPWM12A/SPICLKB/SD1_D4)
GPIO23: U14.K4(GPIO23/EQEP1I/MFSXA/SCIRXDB/EPWM12B/SPISTEB/SD1_C4)
GPIO24/OPXBAR1: U14.K3(GPIO24/OUTPUTXBAR1/EQEP2A/MDXB/SPISIMOB/SD2_D1)
GPIO25/OPXBAR2: U14.K2(GPIO25/OUTPUTXBAR2/EQEP2B/MDRB/SPISOMIB/SD2_C1)
GPIO26/SD2D2: U14.K1(GPIO26/OUTPUTXBAR3/EQEP2I/MCLKXB/OUTPUTXBAR3/SPICLKB/SD2_D2)
GPIO27/SD2CLK2: U14.L1(GPIO27/OUTPUTXBAR4/EQEP2S/MFSXB/OUTPUTXBAR4/SPISTEB/SD2_C2)
GPIO28: U14.V11(GPIO28/SCIRXDA/EM1CS4/OUTPUTXBAR5/EQEP3A/SD2_D3)
GPIO29: R75.1 R76.1 U14.W11(GPIO29/SCITXDA/EM1SDCKE/OUTPUTXBAR6/EQEP3B/SD2_C3)
GPIO29/J9: J9.58(RSVD2) R76.2
GPIO29/OPXBAR6: R75.2
GPIO30: J9.46(RSVD1) U14.T11(GPIO30/CANRXA/EM1CLK/OUTPUTXBAR7/EQEP3S/SD2_D4)
GPIO31: J9.45(NWR) U14.U11(GPIO31/CANTXA/EM1WE/OUTPUTXBAR8/EQEP3I/SD2_C4)
GPIO32: J9.59(RSVD3) U14.U13(GPIO32/SDAA/EM1CS0)
GPIO33: U14.T13(GPIO33/SCLA/EM1RNW)
GPIO34: J9.43(CSN) U14.U14(GPIO34/OUTPUTXBAR1/EM1CS2/SDAB)
GPIO35: U14.T14(GPIO35/SCIRXDA/EM1CS3/SCLB)
GPIO36: J9.50(BUSY) U14.V16(GPIO36/SCITXDA/EM1WAIT/CANRXA)
GPIO37: J9.44(NRD) U14.U16(GPIO37/OUTPUTXBAR2/EM1OE/CANTXA)
GPIO38: J9.4(A2) U14.T16(GPIO38/EM1A0/SCITXDC/CANTXB)
GPIO39: J9.5(A3) U14.W17(GPIO39/EM1A1/SCIRXDC/CANRXB)
GPIO40/I2CSDAB: R67.1 R68.1 U14.V17(GPIO40/EM1A2/SDAB)
GPIO40/I2CSDAB/J5: R67.2
GPIO40/I2CSDAB/J9: J9.6(A4) R68.2
GPIO41/I2CSCLB: R69.1 R70.1 U14.U17(GPIO41/EM1A3/SCLB)
GPIO41/I2CSCLB/J5: R69.2
GPIO41/I2CSCLB/J9: J9.7(A5) R70.2
GPIO42/SCIATX(<-MCU): U14.D19(GPIO42/SDAA/SCITXDA/USB0DM)
GPIO43/SCIARX(->MCU): U14.C19(GPIO43/SCLA/SCIRXDA/USB0DP)
GPIO44: J9.8(A6) U14.K18(GPIO44/EM1A4)
GPIO45: J9.9(A7) U14.K19(GPIO45/EM1A5)
GPIO46: J9.11(A8) U14.E19(GPIO46/EM1A6/SCIRXDD)
GPIO47: J9.12(A9) U14.E18(GPIO47/EM1A7/SCITXDD)
GPIO48: J9.13(A10) U14.R16(GPIO48/OUTPUTXBAR3/EM1A8/SCITXDA/SD1_D1)
GPIO49: J9.14(A11) U14.R17(GPIO49/OUTPUTXBAR4/EM1A9/SCIRXDA/SD1_C1)
GPIO50: J9.15(A12) U14.R18(GPIO50/EQEP1A/EM1A10/SPISIMOC/SD1_D2)
GPIO51: J9.16(A13) U14.R19(GPIO51/EQEP1B/EM1A11/SPISOMIC/SD1_C2)
GPIO52: R77.1 R78.1
GPIO52/J5: R77.2
GPIO52/J9: J9.20(E2PROM_LOAD) R78.2
GPIO69: J9.41(D15)
GPIO70: J9.40(D14)
GPIO71: J9.39(D13)
GPIO72: J9.38(D12)
GPIO73: J9.37(D11)
GPIO74: J9.36(D10)
GPIO75: J9.35(D9)
GPIO76: J9.34(D8)
GPIO77: J9.28(D7)
GPIO78: J9.27(D6/SPI_INT)
GPIO79: J9.26(D5)
GPIO80: J9.25(D4)
GPIO81: J9.24(D3)
GPIO82: J9.23(D2)
GPIO83: J9.22(D1)
GPIO85: J9.21(D0)
GPIO86: J9.47(SYNC/LATCH0)
GPIO87: J9.48(SYNC/LATCH1)
GPIO88: J9.17(A14)
GPIO89: J9.18(A15)
GPIO92: J9.3(A1)
GPIO93: J9.2(A0)
GPIO100: J9.32(SPI_SIMOA)
GPIO101: J9.33(SPI_SOMIA)
GPIO102: J9.31(SPI_CLK)
GPIO103: J9.30(SPI_SEL)
GPIO104/I2CSDAA: R71.1 R72.1
GPIO104/I2CSDAA/J1: R71.2
GPIO104/I2CSDAA/J9: J9.55(I2C-SDA) R72.2
GPIO105/I2CSCLA: R73.1 R74.1
GPIO105/I2CSCLA/J1: R73.2
GPIO105/I2CSCLA/J9: J9.54(I2C-SCL) R74.2
GPIO107: J9.49(EMIF_INT)
GPIO108: J9.60(ETRESETN)

### Notes on the sheet
- COMPANY:
- Texas
  Instruments Inc.
- JackLei
- Drawn
- Checked
- DannyFang
- Appeoved
- TITLE:
- Document Number:
- LAUNCHXL-F28379D
- REV:
- 2.0
- Date:
- TMS320F28379D-IO2
- Sheet:
- 9
- 1
- 2
- 3
- 4
- 5
- 6
- A
- B
- C
- D
- E

### Library data of the parts
J9 = 1009015100039: CONN HDR 60POS 0.4MM SMD GOLD TR; Manufacturer: HIROSE; Embest PN: 1009015100039; Value: DF40C-60DP-0.4V(51); Part Type: BTB Connector; Manufacturer Part Number: DF40C-60DP-0.4V(51)
R67-R78 = 1003001100161: RES,0R,+/-5%,1/10W,SMD0603; Manufacturer: YAGEO; Manufacturer Part Number: RC0603JR-070RL; Embest PN: 1003001100161; Value: 0R; Part Type: Thick film Resistor
U14 = 1002002100202C: as U14 on sheet P07_F28379D-PWR; Embest PN: 1002002100202C; Value: TMS320F28379DZWTT; Part Type: MCU; Manufacturer Part Number: TMS320F28379DZWTT